# EasyEDA Pro project OctoSlime_Base_Unit.eprj

# Schematic Octoslime

## Sheets
1 I2C breakout and OLED
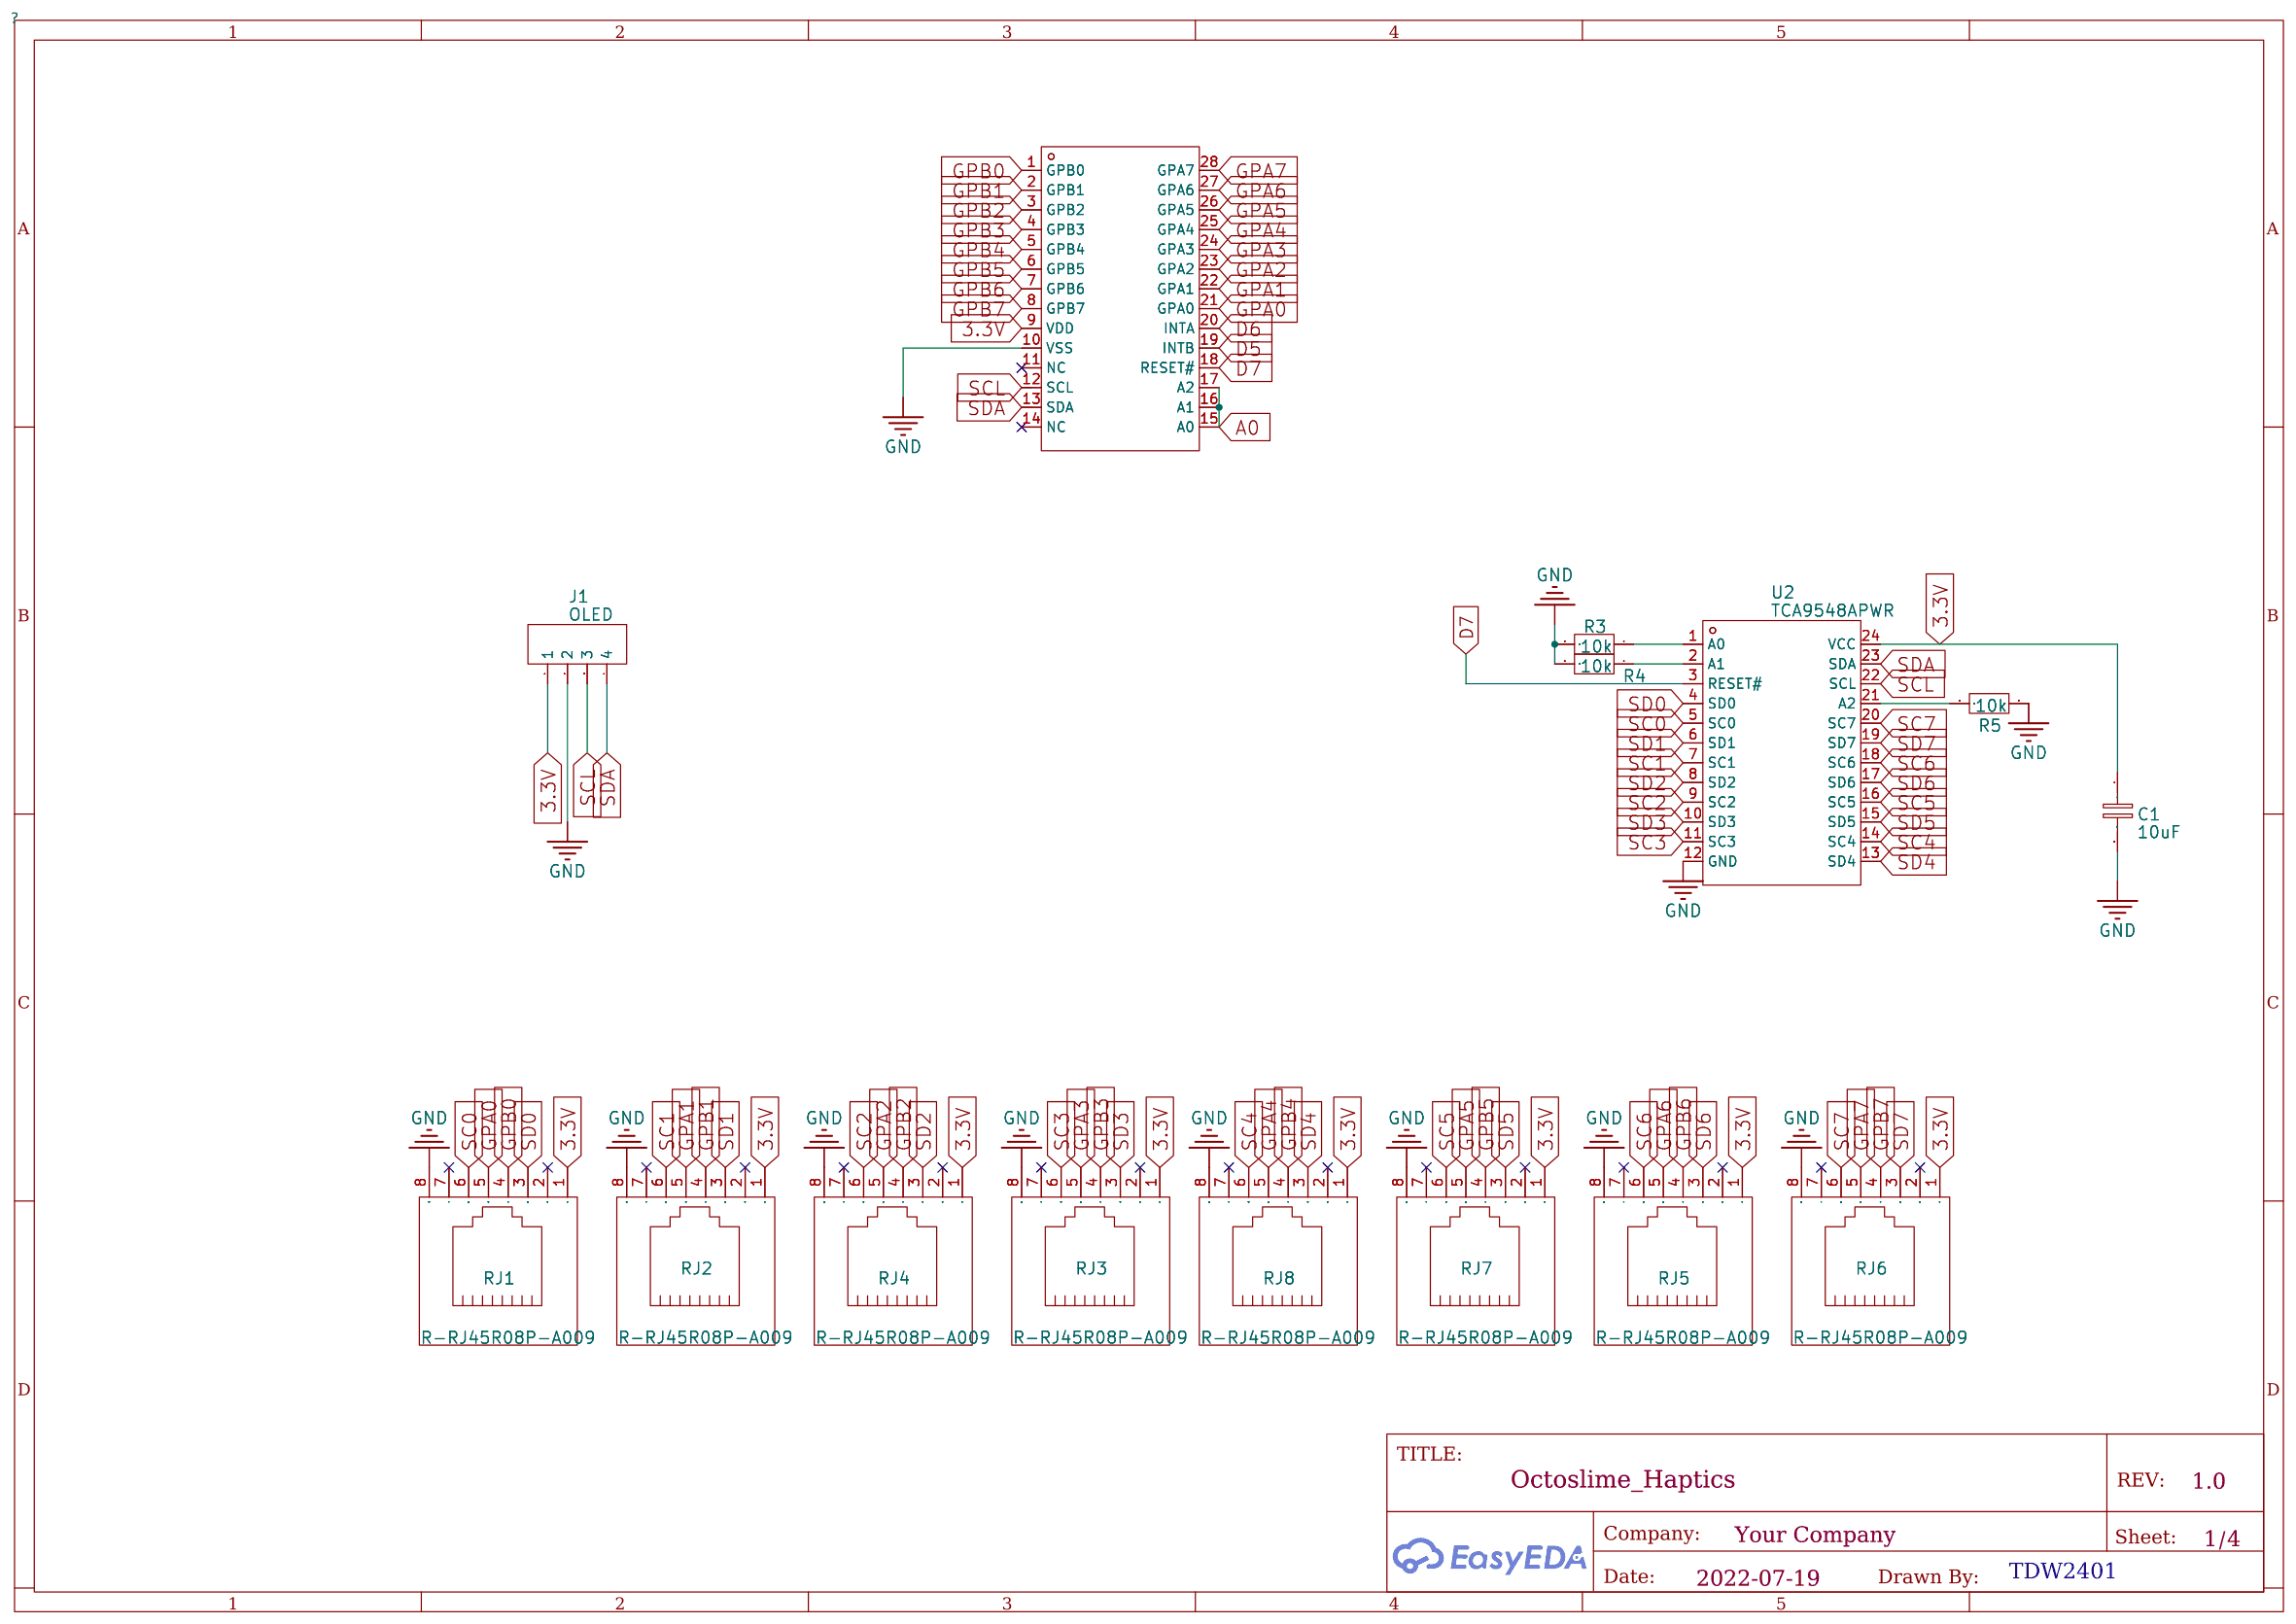
[diagram p0: I2C breakout and OLED]
2 Charge / data
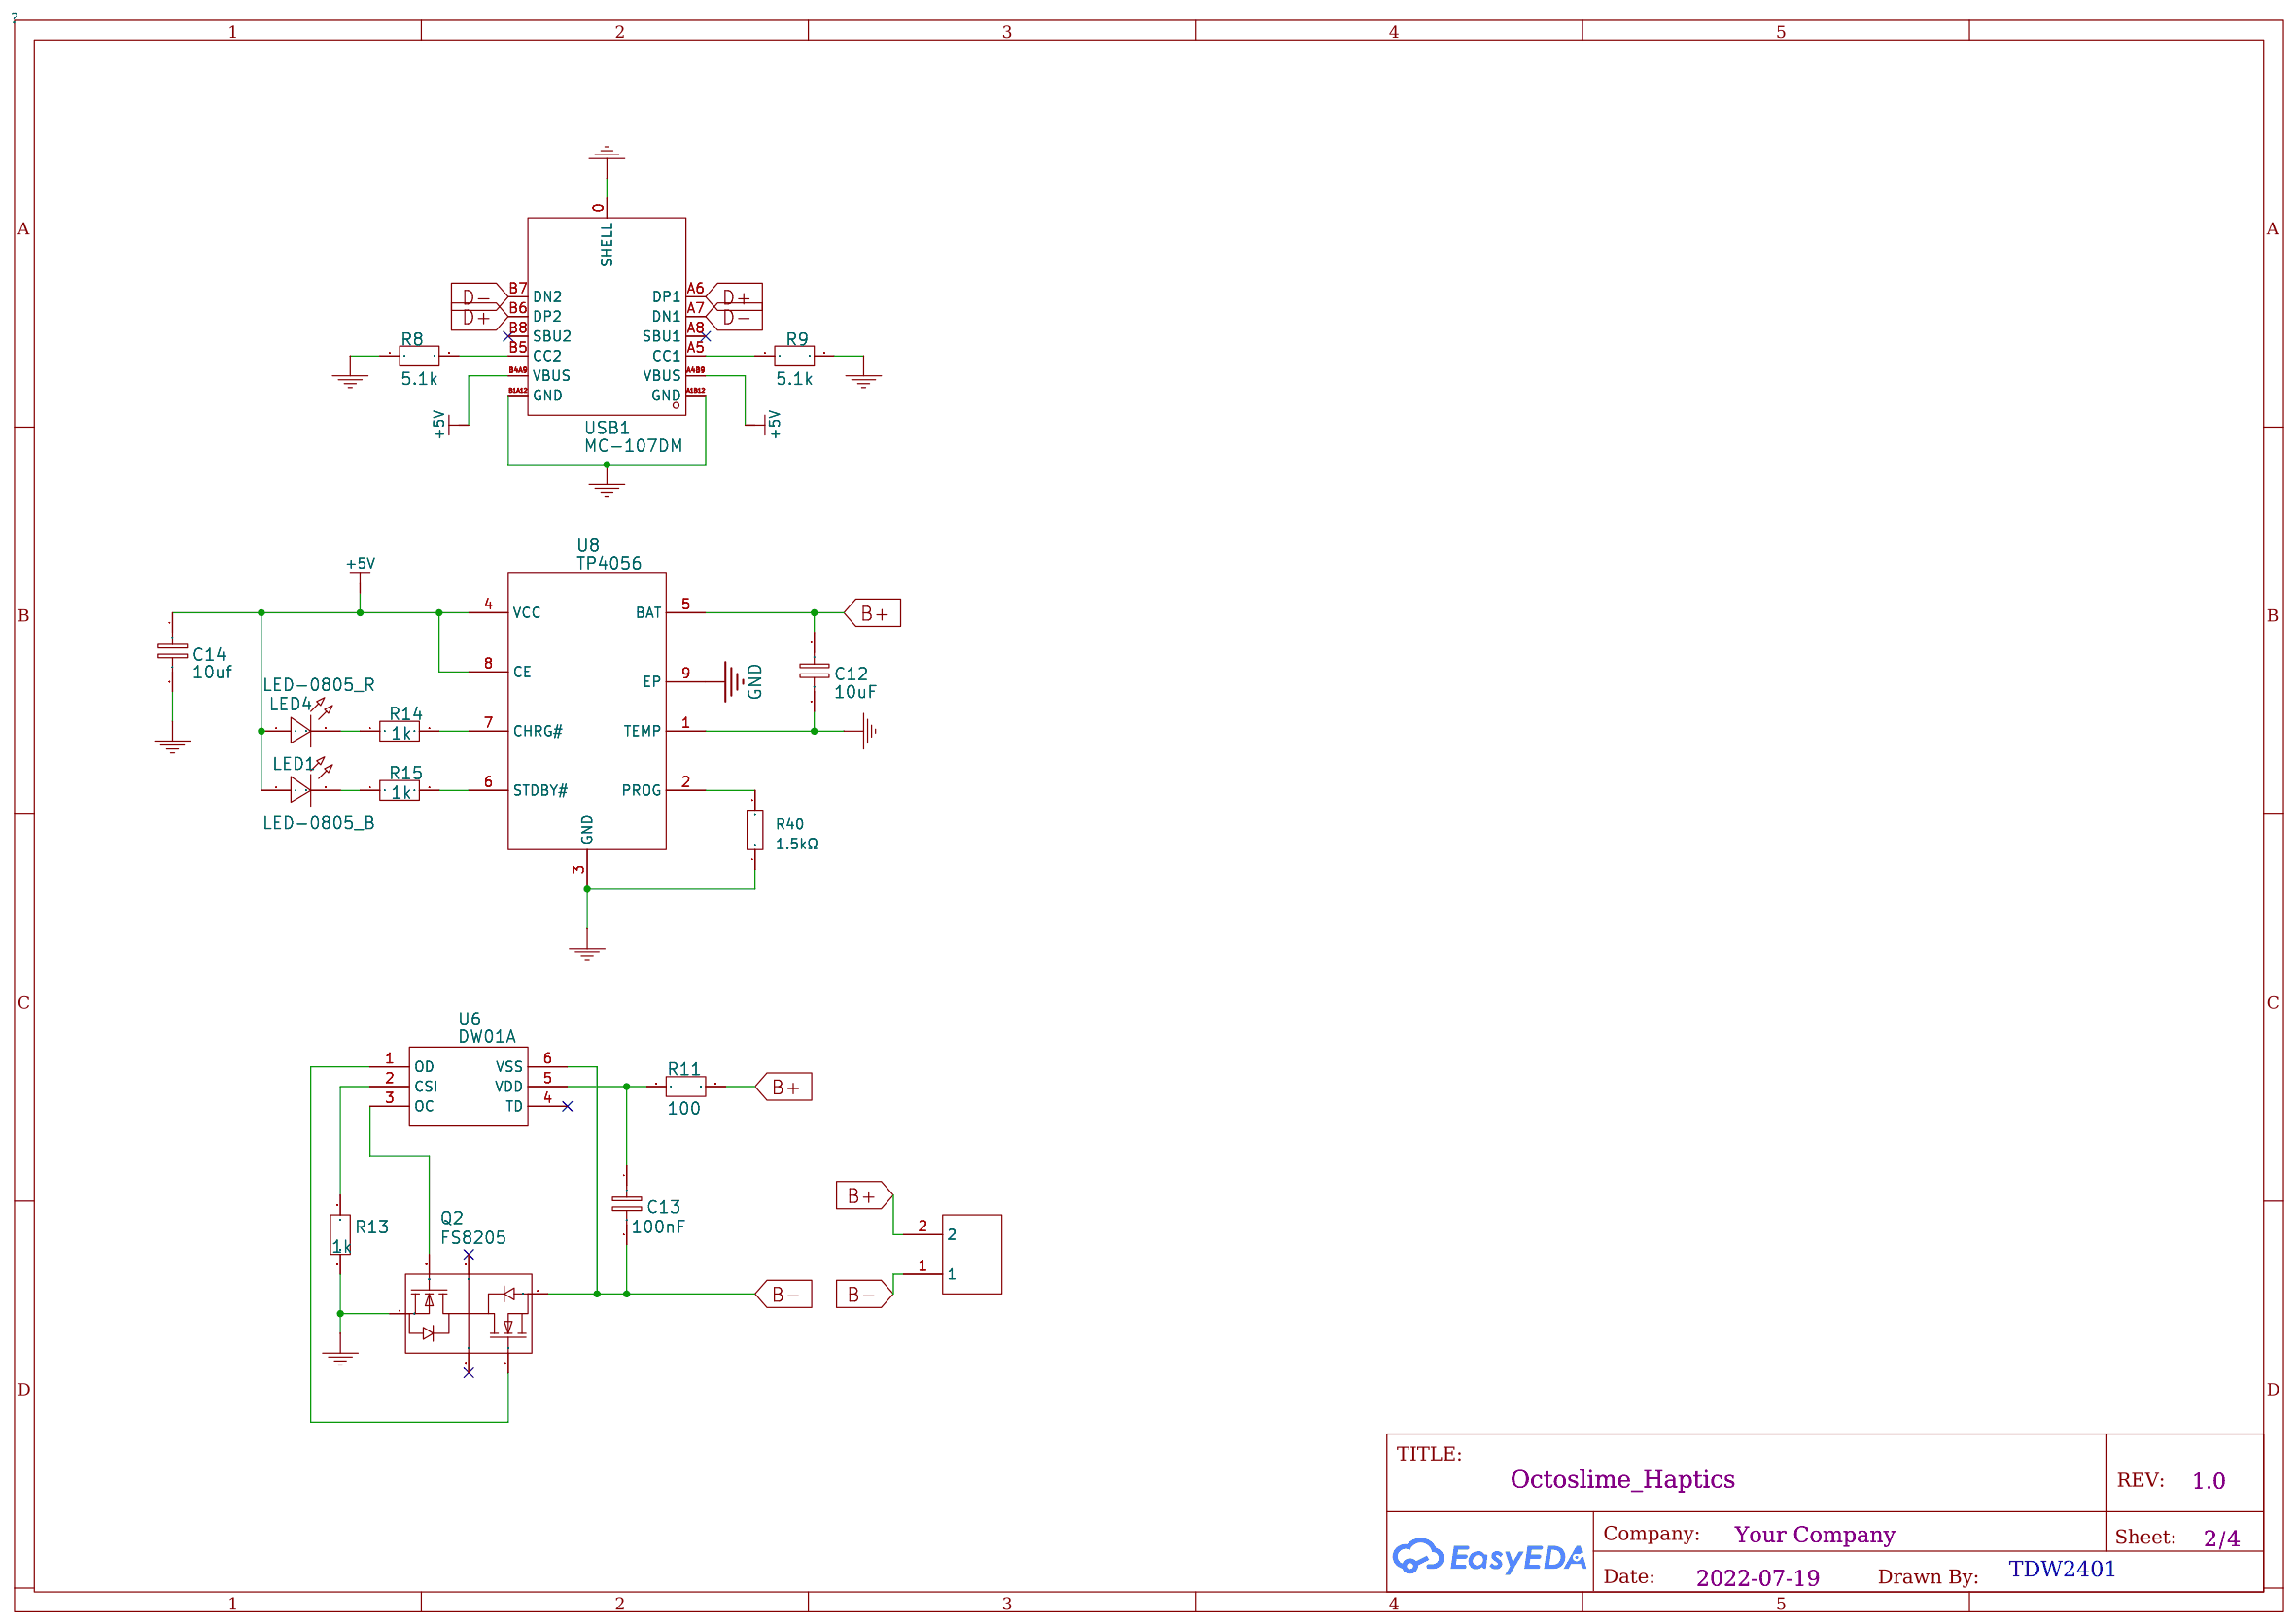
[diagram p1: Charge / data]
3 MCU
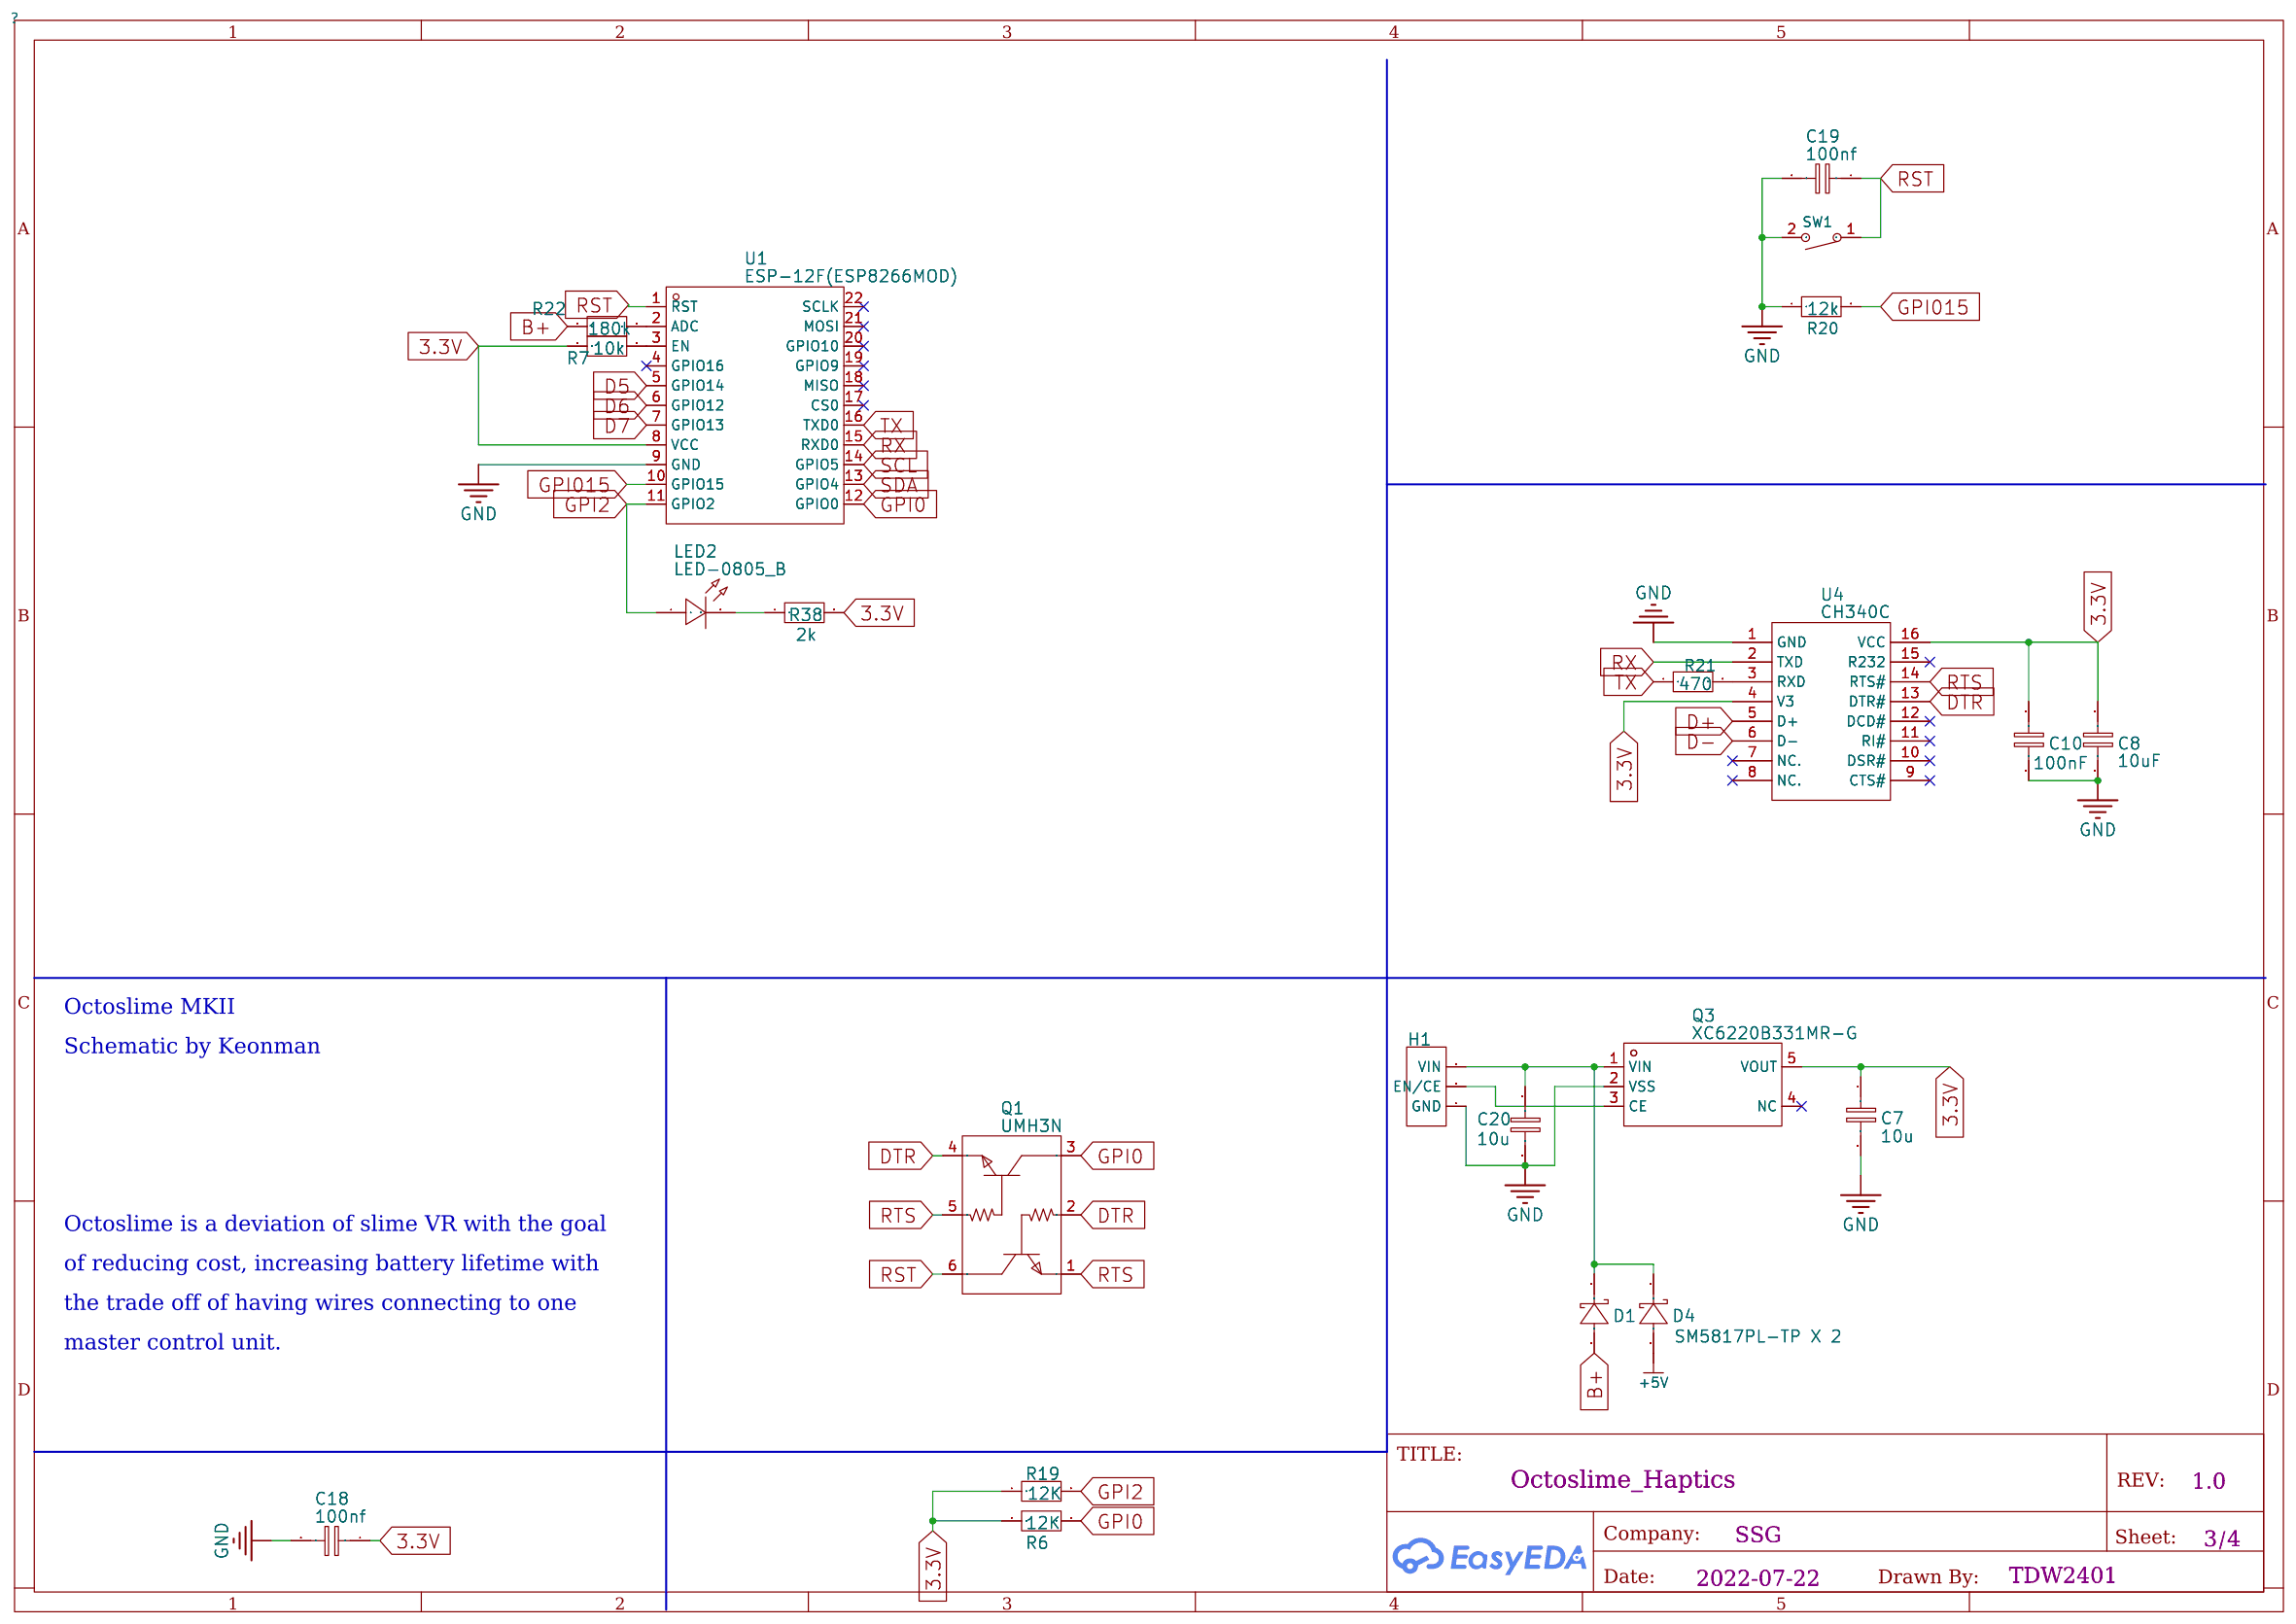
[diagram p2: MCU]
4 I2C thing - ma - jigXC6220B331PR-G
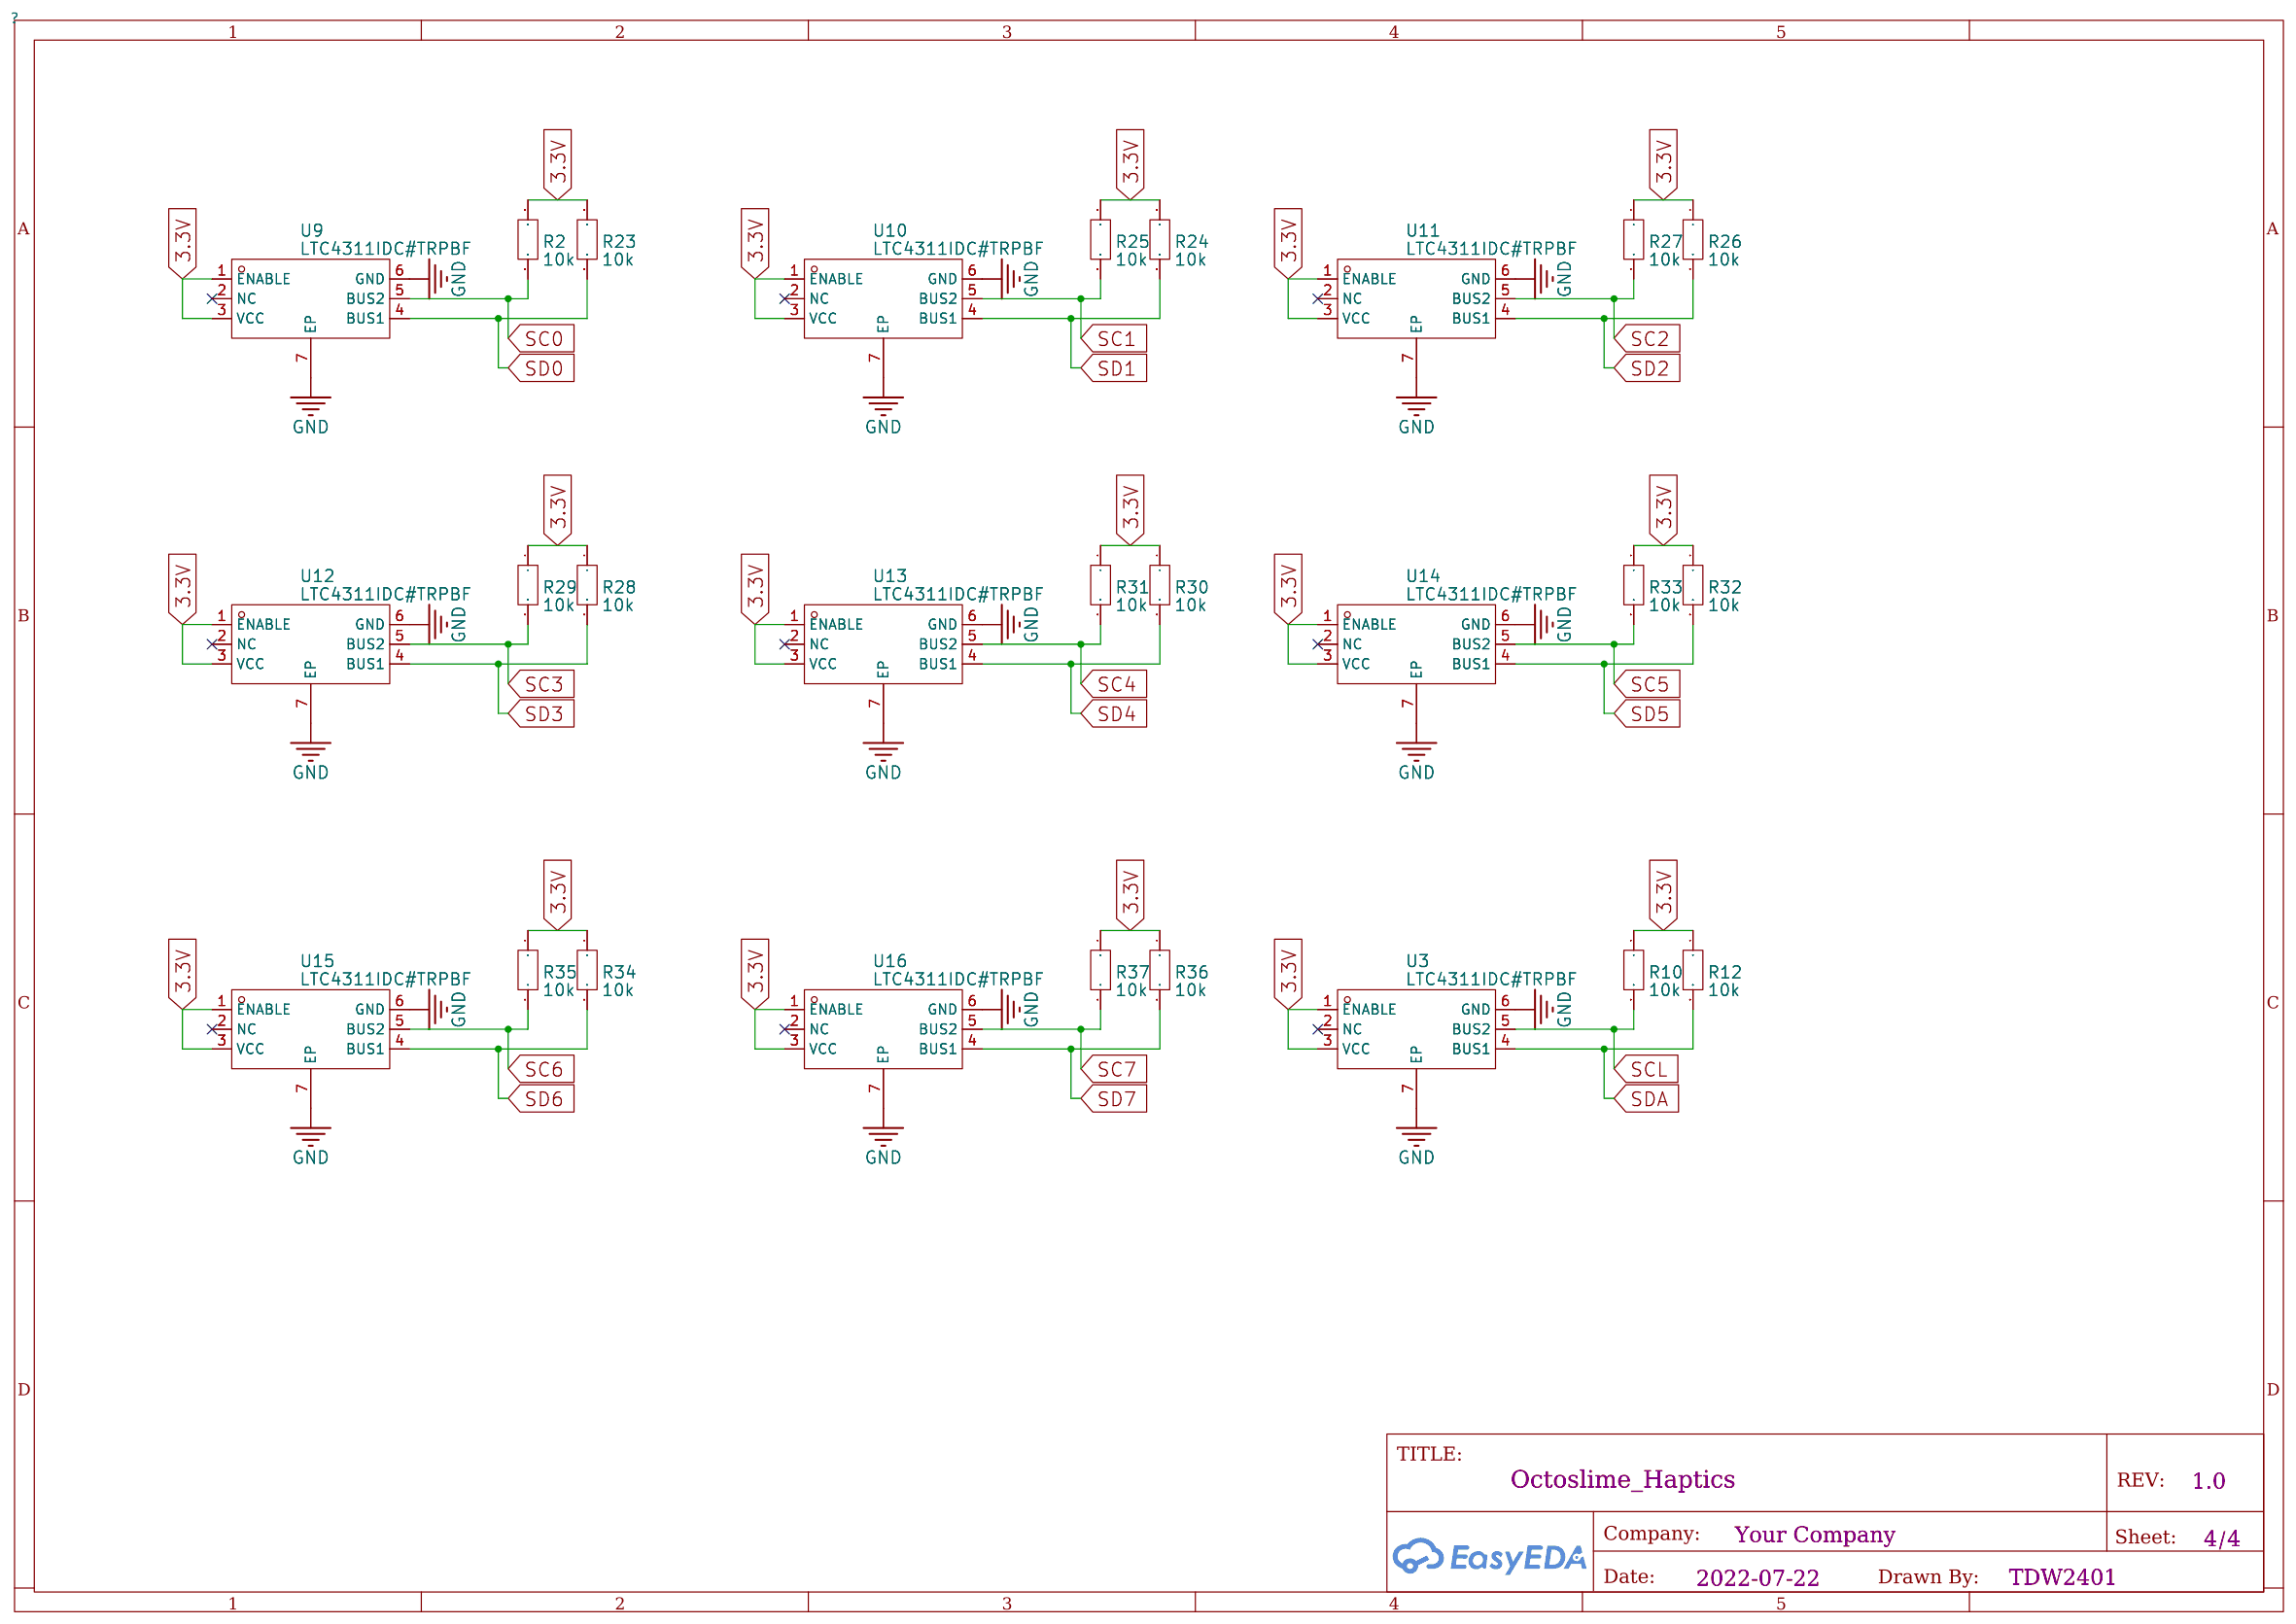
[diagram p3: I2C thing - ma - jigXC6220B331PR-G]

## Parts
sheet Charge / data
C12  10uF  [C0805]
C13  100nF  [C0805]
C14  10uf  [C0805]
CN8  B2B-PH-K-S(LF)(SN)  [CONN-TH_B2B-PH-K-S]
LED1  LED-0805_B  [LED0805_BLUE]
LED4  LED-0805_R  [LED0805_RED]
Q2  FS8205  [SOT-23-6_L2.9-W1.6-P0.95-LS2.8-BR]
R8  5.1k  [R0805]
R9  5.1k  [R0805]
R11  100  [R0805]
R13  1k  [R0805]
R14  1k  [R0805]
R15  1k  [R0805]
R40  1.5kΩ  [R0805]
U6  DW01A  [SOT-23-6_L2.9-W1.6-P0.95-LS2.8-BL]
U8  TP4056  [ESOP-8_L4.9-W3.9-P1.27-LS6.0-BL-EP]
USB1  MC-107DM  [USB-C-SMD_MC-107D]
sheet I2C breakout and OLED
C1  10uF  [C0805]
J1  OLED  [HDR-M-2.54_1X4]  (no BOM)
R3  10k  [R0805]
R4  10k  [R0805]
R5  10k  [R0805]
RJ1  R-RJ45R08P-A009  [RJ45-TH_R-RJ45R08P-A009]
RJ2  R-RJ45R08P-A009  [RJ45-TH_R-RJ45R08P-A009]
RJ3  R-RJ45R08P-A009  [RJ45-TH_R-RJ45R08P-A009]
RJ4  R-RJ45R08P-A009  [RJ45-TH_R-RJ45R08P-A009]
RJ5  R-RJ45R08P-A009  [RJ45-TH_R-RJ45R08P-A009]
RJ6  R-RJ45R08P-A009  [RJ45-TH_R-RJ45R08P-A009]
RJ7  R-RJ45R08P-A009  [RJ45-TH_R-RJ45R08P-A009]
RJ8  R-RJ45R08P-A009  [RJ45-TH_R-RJ45R08P-A009]
U2  TCA9548APWR  [TSSOP-24_L7.8-W4.4-P0.65-LS6.4-BL]
U7  -  [SOIC-28_L18.0-W7.5-P1.27-LS10.3-BL]
sheet I2C thing - ma - jigXC6220B331PR-G
R2  10k  [R0805]
R10  10k  [R0805]
R12  10k  [R0805]
R23  10k  [R0805]
R24  10k  [R0805]
R25  10k  [R0805]
R26  10k  [R0805]
R27  10k  [R0805]
R28  10k  [R0805]
R29  10k  [R0805]
R30  10k  [R0805]
R31  10k  [R0805]
R32  10k  [R0805]
R33  10k  [R0805]
R34  10k  [R0805]
R35  10k  [R0805]
R36  10k  [R0805]
R37  10k  [R0805]
U3  LTC4311IDC#TRPBF  [DFN-6_L2.0-W2.0-P0.50-BL-EP]
U9  LTC4311IDC#TRPBF  [DFN-6_L2.0-W2.0-P0.50-BL-EP]
U10  LTC4311IDC#TRPBF  [DFN-6_L2.0-W2.0-P0.50-BL-EP]
U11  LTC4311IDC#TRPBF  [DFN-6_L2.0-W2.0-P0.50-BL-EP]
U12  LTC4311IDC#TRPBF  [DFN-6_L2.0-W2.0-P0.50-BL-EP]
U13  LTC4311IDC#TRPBF  [DFN-6_L2.0-W2.0-P0.50-BL-EP]
U14  LTC4311IDC#TRPBF  [DFN-6_L2.0-W2.0-P0.50-BL-EP]
U15  LTC4311IDC#TRPBF  [DFN-6_L2.0-W2.0-P0.50-BL-EP]
U16  LTC4311IDC#TRPBF  [DFN-6_L2.0-W2.0-P0.50-BL-EP]
sheet MCU
C7  10u  [C0805]
C8  10uF  [C0805]
C10  100nF  [C0805]
C18  100nf  [C0805]
C19  100nf  [C0805]
C20  10u  [C0805]
D1  SM5817PL-TP X 2  [SOD-123FL_L2.8-W1.7-LS3.6-RD]
D4  SM5817PL-TP X 2  [SOD-123FL_L2.8-W1.7-LS3.6-RD]
H1  HDR-F-2.54_1x3  [HDR-F-2.54_1X3]  (no BOM)
LED2  LED-0805_B  [LED0805_BLUE]
Q1  UMH3N  [SC-70-6_L2.2-W1.3-P0.65-LS2.1-BR]
Q3  XC6220B331MR-G  [SOT-25-5_L3.0-W1.8-P0.95-LS3.0-BR]
R6  12K  [R0805]
R7  10k  [R0805]
R19  12K  [R0805]
R20  12k  [R0805]
R21  470  [R0805]
R22  180k  [R0805]
R38  2k  [R0805]
SW1  -  [SW-SMD_L4.0-W2.9-LS5.0]
U1  ESP-12F(ESP8266MOD)  [WIFIM-SMD_ESP-12F-ESP8266MOD]
U4  CH340C  [SOP-16_L10.0-W3.9-P1.27-LS6.0-BL]

## Library data of the parts
C1 C8 C12 = 10uF: link: https://item.szlcsc.com/373011.html; 3DModel: C0805_L2.0-W1.3-H1.3
C10 C13 = 100nF: link: https://item.szlcsc.com/373011.html; 3DModel: C0805_L2.0-W1.3-H1.3
C14 = 10uf: link: https://item.szlcsc.com/373011.html; 3DModel: C0805_L2.0-W1.3-H1.3
CN8 = B2B-PH-K-S(LF)(SN): link: https://item.szlcsc.com/142630.html; 3DModel: CONN-TH_PH2.00-LI-2P; Supplier: LCSC; Manufacturer: JST; Supplier Part: C131337; JLCPCB Part Class: Extended Part
LED1 LED2 = LED-0805_B: 3DModel: LED0805_Blue; Manufacturer: 方舟 ARKLED; Manufacturer Part: D-B080508B1-KS2; Supplier Part: C108412
LED4 = LED-0805_R: 3DModel: LED0805_Red; Manufacturer: EVERLIGHT(台湾亿光); Manufacturer Part: 17-21SURC/S530-A3/TR8; Supplier Part: C72037
Q2 = FS8205: link: https://item.szlcsc.com/169042.html; 3DModel: SOT-23-6_L2.9-W1.6-H1.5-LS2.8-P0.95; Supplier: LCSC; Manufacturer: FORTUNE; Supplier Part: C32254; JLCPCB Part Class: Extended Part
R8 R9 = 5.1k: link: https://item.szlcsc.com/142685.html; 3DModel: R0805_L2.0-W1.3-H0.6
R11 = 100: link: https://item.szlcsc.com/142685.html; 3DModel: R0805_L2.0-W1.3-H0.6
R13-R15 = 1k: link: https://item.szlcsc.com/142685.html; 3DModel: R0805_L2.0-W1.3-H0.6
R40 = 0805W8F1501T5E: 电阻类型:厚膜电阻;阻值:1.5kΩ;精度:±1%;功率:125mW;温度系数:±100ppm/;最大工作电压:150V;工作温度范围:-55~+155;; LCSC Part Name: 1.5kΩ ±1% 125mW; Supplier Part: C4310; Manufacturer: UNI-ROYAL(厚声); Supplier Footprint: 0805; JLCPCB Part Class: Basic Part; Datasheet: https://atta.szlcsc.com/upload/public/pdf/source/20200306/C422600_1E6D84923E4A46A82E41ADD87F860B5C.pdf; Supplier: LCSC; Type: 厚膜电阻; Tolerance: ±1%; Power(Watts): 125mW; Temperature Coefficient: ±100ppm/; Overload Voltage (Max): 150V; Operating Temperature Range: -55~+155
U6 = DW01A: link: https://item.szlcsc.com/169042.html; 3DModel: SOT-23-6_L2.9-W1.6-H1.5-LS2.8-P0.95; Supplier: LCSC; Manufacturer: FM; Supplier Part: C85680; JLCPCB Part Class: Extended Part
U8 = TP4056: link: https://www.mornsun.cn/html/pdf/SCM1501B.html; 3DModel: ESOP-8_L4.9-W3.9-H1.6-LS6.0-P1.27; Supplier: LCSC; Manufacturer: TOPPOWER; Supplier Part: C16581; JLCPCB Part Class: Basic Part
USB1 = MC-107DM: link: https://atta.szlcsc.com/upload/public/pdf/source/20210810/6DD818F077A767CCD2FDFBDED48F58DC.pdf; Supplier: LCSC; Supplier Part: C2874569; Manufacturer: 台湾汉博; JLCPCB Part Class: Extended Part
J1 = OLED: 3DModel: HDR-M-2.54_1x4; Supplier Part: C124378; Supplier: LCSC
R2-R5 R7 R10 R12 R23-R37 = 10k: link: https://item.szlcsc.com/142685.html; 3DModel: R0805_L2.0-W1.3-H0.6
RJ1-RJ8 = R-RJ45R08P-A009: link: https://atta.szlcsc.com/upload/public/pdf/source/20211021/D54662BD8381AD1D1DF920996089EE18.pdf; Supplier: LCSC; Supplier Part: C2902700; Manufacturer: Ckmtw(灿科盟); JLCPCB Part Class: Extended Part
U2 = TCA9548APWR: link: https://item.szlcsc.com/6601.html; 3DModel: TSSOP-24_L7.8-W4.4-H1.0-LS6.4-P0.65; Supplier: LCSC; Manufacturer: TI; Supplier Part: C130026; JLCPCB Part Class: Extended Part
U7 = MCP23017-E/SO: Number of I/O:16 Interface:I²C Interrupt Output:是 Features:POR Output Type:推挽式 Current - Output Source/Sink:25mA Clock Frequency:1.7MHz Voltage - Supply:1.8V ~ 5.5V Operating Temperature:-40~125 Mounting Type:表面贴装; Supplier Part: C47023; Manufacturer: MICROCHIP(美国微芯); Supplier Footprint: SOIC-28_300mil; JLCPCB Part Class: Extended Part; Datasheet: https://atta.szlcsc.com/upload/public/pdf/source/20150427/1457707279254.pdf; Supplier: LCSC; Number of I/O: 16; Interface: I²C; Interrupt Output: 是; Features: POR; Output Type: 推挽式; Current - Output Source/Sink: 25mA; Clock Frequency: 1.7MHz; Voltage - Supply: 1.8V ~ 5.5V; Operating Temperature: -40~125; Mounting Type: 表面贴装
U3 U9-U16 = LTC4311IDC#TRPBF: link: https://item.szlcsc.com/216405.html; 3DModel: DFN-6_L2.0-W2.0-H0.8-P0.50; Supplier: LCSC; Supplier Part: C688096; Manufacturer: Analog Devices; JLCPCB Part Class: Extended Part
C7 C20 = 10u: link: https://item.szlcsc.com/373011.html; 3DModel: C0805_L2.0-W1.3-H1.3
C18 C19 = 100nf: link: https://item.szlcsc.com/373011.html; 3DModel: C0805_L2.0-W1.3-H1.3
D1 D4 = SM5817PL-TP X 2: link: https://item.szlcsc.com/771782.html; Supplier: LCSC; Supplier Part: C669022; Manufacturer: MCC(Micro Commercial Components); Manufacturer Part: SM5817PL-TP; JLCPCB Part Class: Extended Part
H1 = HDR-F-2.54_1x3: link: https://www.cjt.com/Upload/A2541.pdf; Supplier Part: C146690; Supplier: LCSC
Q1 = UMH3N: link: https://item.szlcsc.com/112963.html; 3DModel: SC-70-6_L2.1-W1.3-H1.0-LS2.1-P0.65; Supplier: LCSC; Manufacturer: CJ; Supplier Part: C62892; JLCPCB Part Class: Extended Part
Q3 = XC6220B331MR-G: link: https://item.szlcsc.com/70677.html; 3DModel: SOT-25-5_L3.0-W1.6-H1.3-LS2.8-P0.95; Supplier: LCSC; Manufacturer: TOREX; Supplier Part: C86534; JLCPCB Part Class: Extended Part
R6 R19 = 12K: link: https://item.szlcsc.com/142685.html; 3DModel: R0805_L2.0-W1.3-H0.6
R20 = 12k: link: https://item.szlcsc.com/142685.html; 3DModel: R0805_L2.0-W1.3-H0.6
R21 = 470: link: https://item.szlcsc.com/142685.html; 3DModel: R0805_L2.0-W1.3-H0.6
R22 = 180k: link: https://item.szlcsc.com/142685.html; 3DModel: R0805_L2.0-W1.3-H0.6
R38 = 2k: link: https://item.szlcsc.com/142685.html; 3DModel: R0805_L2.0-W1.3-H0.6
SW1 = TS342A2P-WZ: LCSC Part Name: 轻触开关 3*4*2 两脚小龟不带柱 250gf 黑色塑胶按钮; Supplier Part: C557591; Manufacturer: SHOU HAN(首韩); Supplier Footprint: SMD; JLCPCB Part Class: Extended Part; Datasheet: https://atta.szlcsc.com/upload/public/pdf/source/20200519/C557591_B3A5A21584733303F06306F18577DA8B.pdf; Supplier: LCSC
U1 = ESP-12F(ESP8266MOD): link: https://item.szlcsc.com/84052.html; 3DModel: WIFIM-SMD_WIFI-L24.0-W16.0-H3.1; Supplier: LCSC; Manufacturer: Ai-Thinker; Supplier Part: C82891; JLCPCB Part Class: Extended Part
U4 = CH340C: link: https://item.szlcsc.com/391677.html; Supplier Part: C84681; Supplier: LCSC; 3DModel: SOP-16_L9.9-W3.9-H1.5-LS6.0-P1.27; Manufacturer: WCH; JLCPCB Part Class: Extended Part

## Nets
3.3V: C1.1 C7.1 C8.1 C10.1 C18.1 J1.1 Q3.5(VOUT) R2.1 R6.1 R7.1 R10.1 R12.1 R19.1 R23.1 R24.1 R25.1 R26.1 R27.1 R28.1 R29.1 R30.1 R31.1 R32.1 R33.1 R34.1 R35.1 R36.1 R37.1 R38.2 RJ1.1 RJ2.1 RJ3.1 RJ4.1 RJ5.1 RJ6.1 RJ7.1 RJ8.1 U1.8(VCC) U2.24(VCC) U3.1(ENABLE) U3.3(VCC) U4.4(V3) U4.16(VCC) U7.9(VDD) U9.1(ENABLE) U9.3(VCC) U10.1(ENABLE) U10.3(VCC) U11.1(ENABLE) U11.3(VCC) U12.1(ENABLE) U12.3(VCC) U13.1(ENABLE) U13.3(VCC) U14.1(ENABLE) U14.3(VCC) U15.1(ENABLE) U15.3(VCC) U16.1(ENABLE) U16.3(VCC)
+5V: C14.1 D4.2(A) LED1.1 LED4.1 U8.4(VCC) U8.8(CE) USB1.A4B9(VBUS) USB1.B4A9(VBUS)
GND: C1.2 C7.2 C8.2 C10.2 C12.2 C14.2 C18.2 C19.2 C20.2 H1.1(GND) J1.2 Q2.1(S1) Q3.2(VSS) R3.2 R4.2 R5.1 R8.1 R9.2 R13.2 R20.1 R40.1 RJ1.8 RJ2.8 RJ3.8 RJ4.8 RJ5.8 RJ6.8 RJ7.8 RJ8.8 SW1.2 U1.9(GND) U2.12(GND) U3.6(GND) U3.7(EP) U4.1(GND) U7.10(VSS) U8.1(TEMP) U8.3(GND) U8.9(EP) U9.6(GND) U9.7(EP) U10.6(GND) U10.7(EP) U11.6(GND) U11.7(EP) U12.6(GND) U12.7(EP) U13.6(GND) U13.7(EP) U14.6(GND) U14.7(EP) U15.6(GND) U15.7(EP) U16.6(GND) U16.7(EP) USB1.0(SHELL) USB1.A1B12(GND) USB1.B1A12(GND)
A0: U7.15(A0) U7.16(A1) U7.17(A2)
B+: C12.1 CN8.2 D1.2(A) R11.2 R22.1 U8.5(BAT)
B-: C13.2 CN8.1 Q2.3(S2) U6.6(VSS)
CHRG#: R14.2 U8.7(CHRG#)
D5: U1.5(GPIO14) U7.19(INTB)
D6: U1.6(GPIO12) U7.20(INTA)
D7: U1.7(GPIO13) U2.3(RESET#) U7.18(RESET#)
D+: U4.5(D+) USB1.A6(DP1) USB1.B6(DP2)
D-: U4.6(D-) USB1.A7(DN1) USB1.B7(DN2)
DTR: Q1.2(B) Q1.4(E) U4.13(DTR#)
GPA0: RJ1.5 U7.21(GPA0)
GPA1: RJ2.5 U7.22(GPA1)
GPA2: RJ4.5 U7.23(GPA2)
GPA3: RJ3.5 U7.24(GPA3)
GPA4: RJ8.5 U7.25(GPA4)
GPA5: RJ7.5 U7.26(GPA5)
GPA6: RJ5.5 U7.27(GPA6)
GPA7: RJ6.5 U7.28(GPA7)
GPB0: RJ1.4 U7.1(GPB0)
GPB1: RJ2.4 U7.2(GPB1)
GPB2: RJ4.4 U7.3(GPB2)
GPB3: RJ3.4 U7.4(GPB3)
GPB4: RJ8.4 U7.5(GPB4)
GPB5: RJ7.4 U7.6(GPB5)
GPB6: RJ5.4 U7.7(GPB6)
GPB7: RJ6.4 U7.8(GPB7)
GPI0: Q1.3(C) R6.2 U1.12(GPIO0)
GPI2: LED2.1 R19.2 U1.11(GPIO2)
GPI015: R20.2 U1.10(GPIO15)
OUT+: C20.1 D1.1(C) D4.1(C) H1.3(VIN) Q3.1(VIN)
RPROG: R40.2 U8.2(PROG)
RST: C19.1 Q1.6(C) SW1.1 U1.1(RST)
RTS: Q1.1(E) Q1.5(B) U4.14(RTS#)
RX: U1.15(RXD0) U4.2(TXD)
SC0: R2.2 RJ1.6 U2.5(SC0) U9.5(BUS2)
SC1: R25.2 RJ2.6 U2.7(SC1) U10.5(BUS2)
SC2: R27.2 RJ4.6 U2.9(SC2) U11.5(BUS2)
SC3: R29.2 RJ3.6 U2.11(SC3) U12.5(BUS2)
SC4: R31.2 RJ8.6 U2.14(SC4) U13.5(BUS2)
SC5: R33.2 RJ7.6 U2.16(SC5) U14.5(BUS2)
SC6: R35.2 RJ5.6 U2.18(SC6) U15.5(BUS2)
SC7: R37.2 RJ6.6 U2.20(SC7) U16.5(BUS2)
SCL: J1.3 R10.2 U1.14(GPIO5) U2.22(SCL) U3.5(BUS2) U7.12(SCL)
SD0: R23.2 RJ1.3 U2.4(SD0) U9.4(BUS1)
SD1: R24.2 RJ2.3 U2.6(SD1) U10.4(BUS1)
SD2: R26.2 RJ4.3 U2.8(SD2) U11.4(BUS1)
SD3: R28.2 RJ3.3 U2.10(SD3) U12.4(BUS1)
SD4: R30.2 RJ8.3 U2.13(SD4) U13.4(BUS1)
SD5: R32.2 RJ7.3 U2.15(SD5) U14.4(BUS1)
SD6: R34.2 RJ5.3 U2.17(SD6) U15.4(BUS1)
SD7: R36.2 RJ6.3 U2.19(SD7) U16.4(BUS1)
SDA: J1.4 R12.2 U1.13(GPIO4) U2.23(SDA) U3.4(BUS1) U7.13(SDA)
STDBY#: R15.2 U8.6(STDBY#)
TX: R21.1 U1.16(TXD0)
$1N65: R4.1 U2.2(A1)
$1N66: R3.1 U2.1(A0)
$1N67: R5.2 U2.21(A2)
$2N78: R8.2 USB1.B5(CC2)
$2N79: R9.1 USB1.A5(CC1)
$2N179: LED1.2 R15.1
$2N191: LED4.2 R14.1
$2N237: Q2.6(G1) U6.3(OC)
$2N238: Q2.4(G2) U6.1(OD)
$2N249: C13.1 R11.1 U6.5(VDD)
$2N267: R13.1 U6.2(CSI)
$3N362: LED2.2 R38.1
$3N452: R7.2 U1.3(EN)
$3N457: R21.2 U4.3(RXD)
$3N474: R22.2 U1.2(ADC)
Net-(H1-2): H1.2(EN/CE) Q3.3(CE)

Not connected (* = marked no-connect by the designer): Q2 2(D12)* 5(D12)*; Q3 4(NC)*; RJ1 2* 7*; RJ2 2* 7*; RJ3 2* 7*; RJ4 2* 7*; RJ5 2* 7*; RJ6 2* 7*; RJ7 2* 7*; RJ8 2* 7*; U1 4(GPIO16)* 17(CS0)* 18(MISO)* 19(GPIO9)* 20(GPIO10)* 21(MOSI)* 22(SCLK)*; U3 2(NC)*; U4 7(NC.)* 8(NC.)* 9(CTS#)* 10(DSR#)* 11(RI#)* 12(DCD#)* 15(R232)*; U6 4(TD)*; U7 11(NC)* 14(NC)*; U9 2(NC)*; U10 2(NC)*; U11 2(NC)*; U12 2(NC)*; U13 2(NC)*; U14 2(NC)*; U15 2(NC)*; U16 2(NC)*; USB1 A8(SBU1)* B8(SBU2)*

## Notes on the sheets
sheet 1
- TDW2401
sheet 2
- TDW2401
sheet 3
- Octoslime MKII
- Schematic by Keonman
- Octoslime is a deviation of slime VR with the goal
- of reducing cost, increasing battery lifetime with
- the trade off of having wires connecting to one
- master control unit.

# Board PCB_PCB_Octoslime_3_2022-08-10_PCB
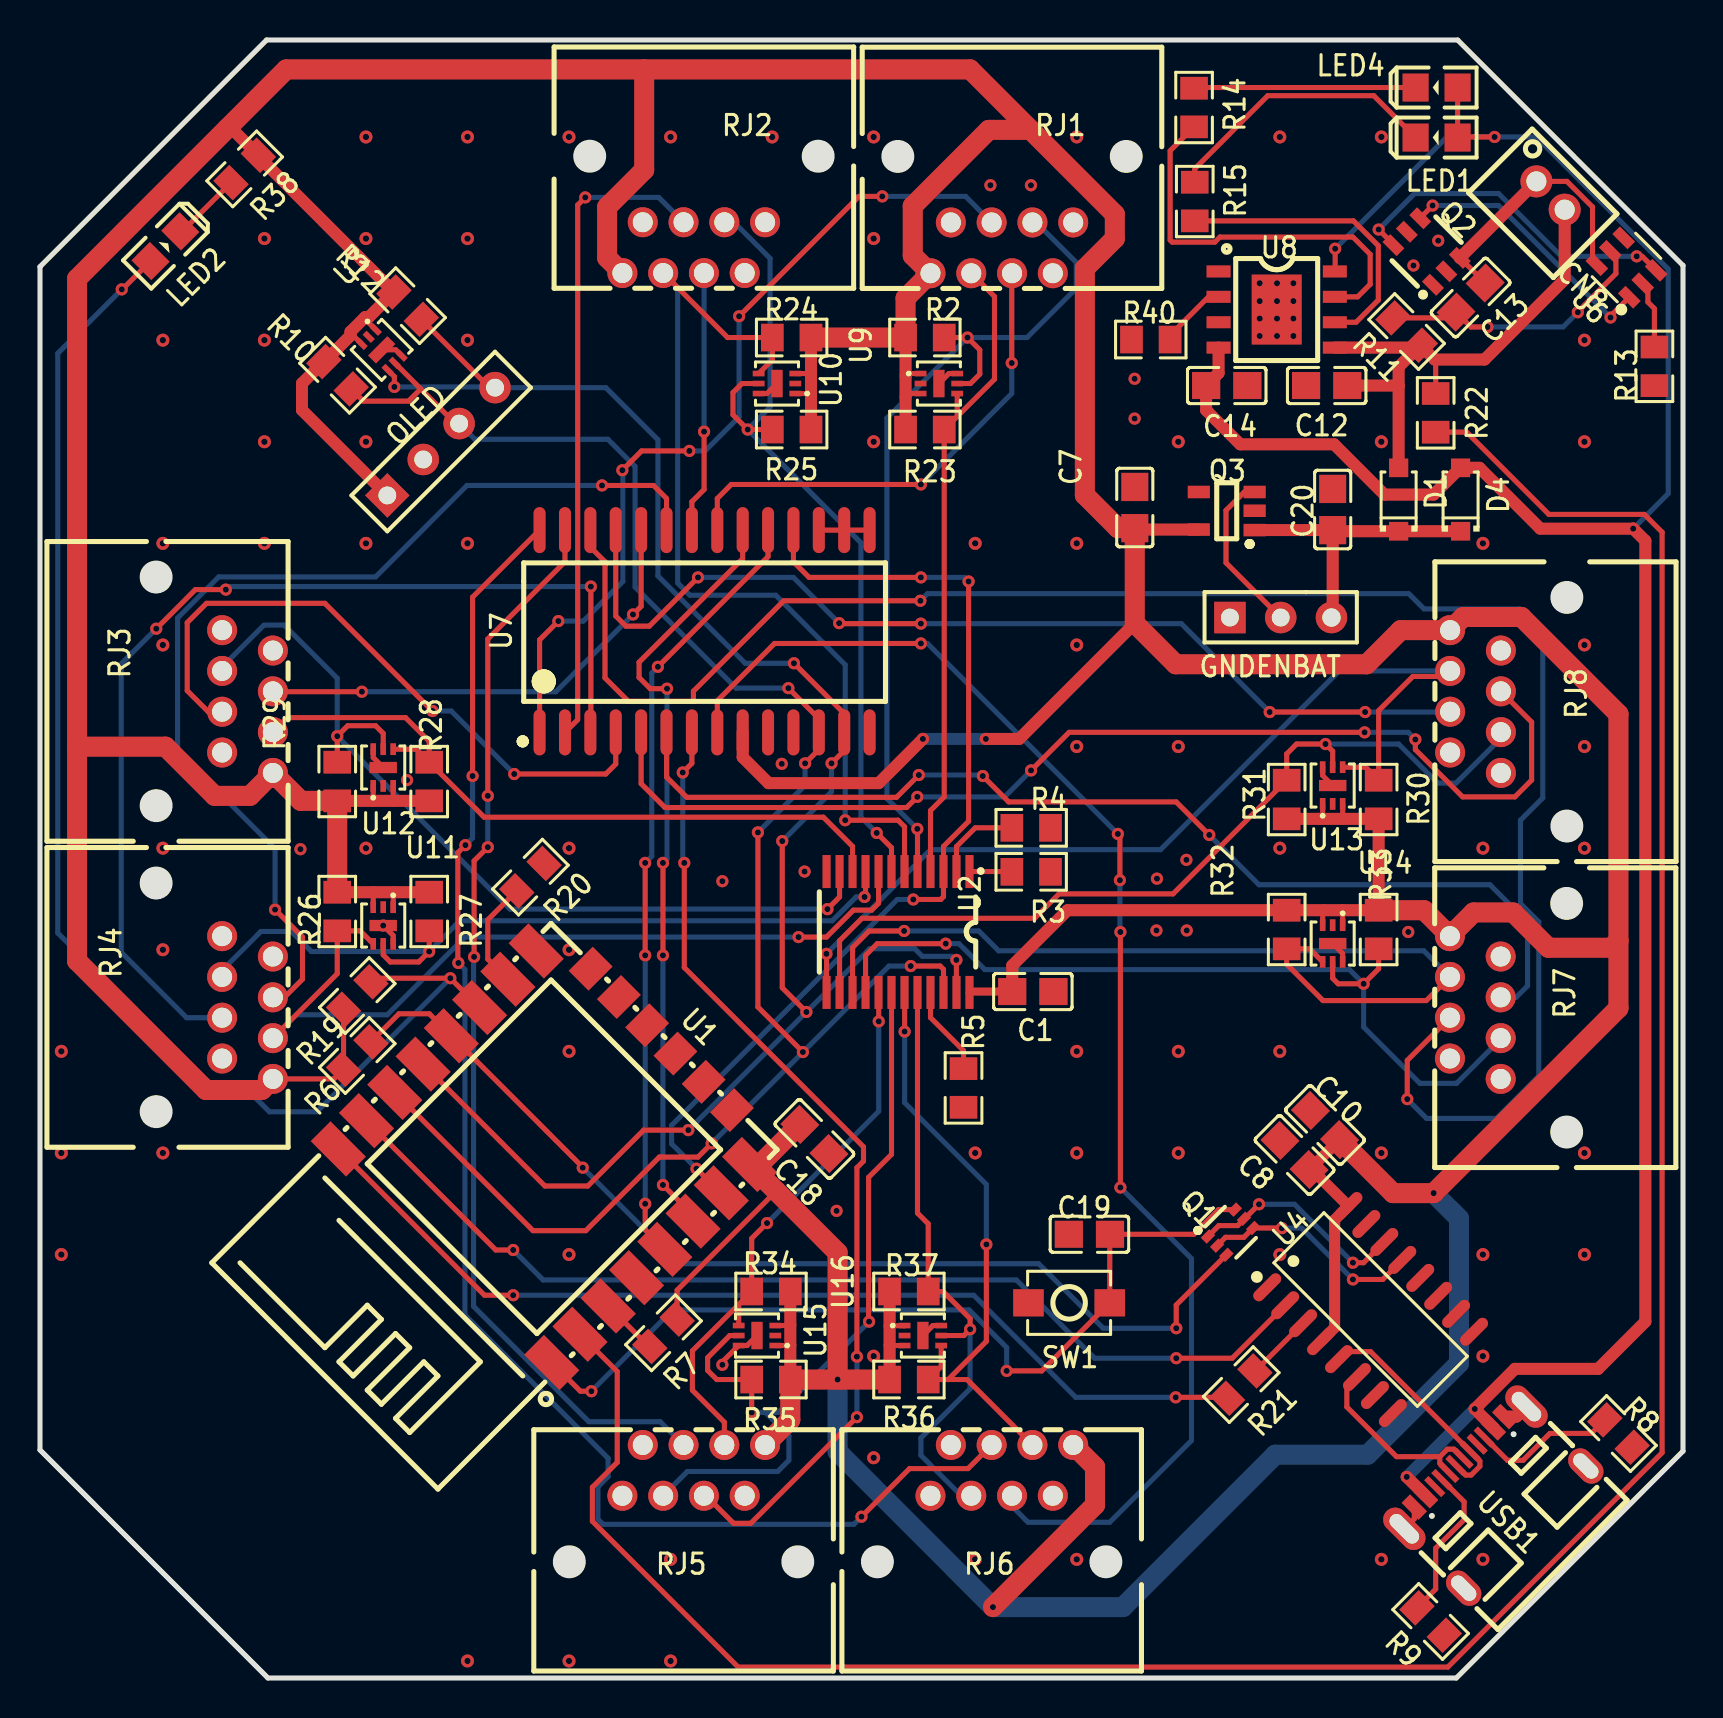
[diagram p4: board, top side]
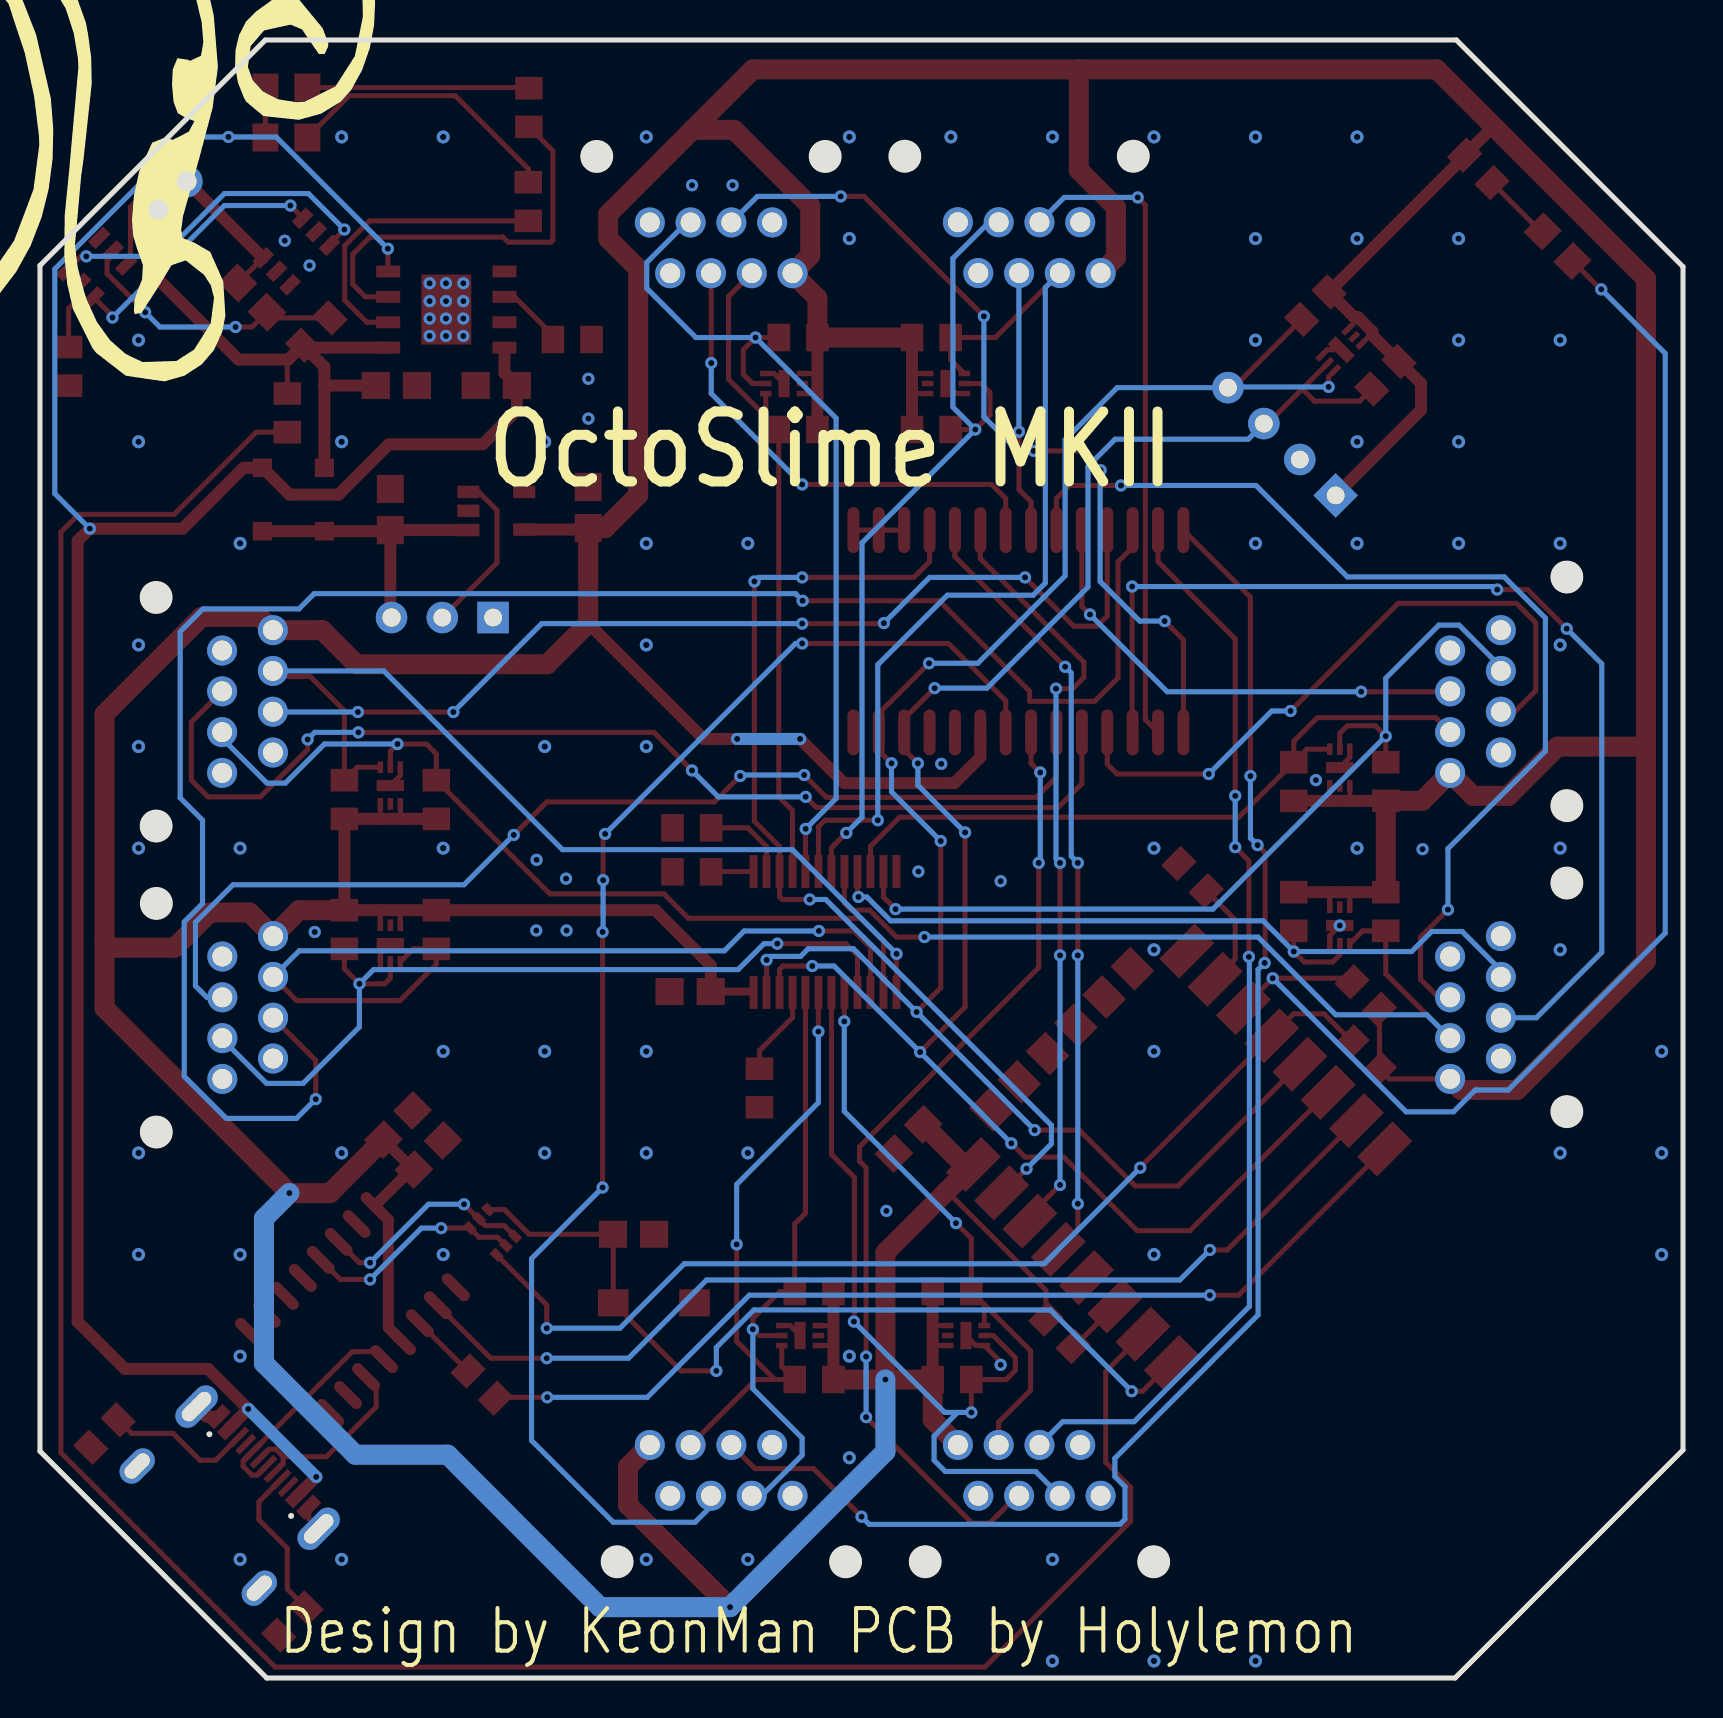
[diagram p5: board, bottom side, seen from below]

Outline 82.2 x 81.9 mm; copper layers: Top Layer, Bottom Layer. Coordinates in mm from the lower left corner of the outline.
Outline path: 0,70.56 11.34,81.9 70.92,81.9 82.2,70.62 82.2,11.34 70.86,0 11.4,0 0,11.4 0,70.56
Stack: Top Layer 0.035mm / Dielectric1 1.51mm FR4 er 4.5 / Bottom Layer 0.035mm

## Design rules (mm)
spacing Default (default): track to track 0.152, other pairs 0 to 0.152
track width Default (default): min 0.254, default 0.254, max 25.4
differential pair differentialPair (default): width min 0.127, default 0.254, max 2.54; gap min 0.152, default 0.152
via Default (default): diameter min 0.61, default 0.61, max 100.025; hole min 0.305, default 0.305, max 59.995

## Placement (name value [footprint] x y rotation side)
C1  10uF  [C0805]  49.67 34.32 0 top
C7  10u  [C0805]  54.77 58.52 90 top
C8  10uF  [C0805]  62.76 26.15 135 top
C10  100nF  [C0805]  64.29 27.65 135 top
C12  10uF  [C0805]  64.37 64.62 180 top
C13  100nF  [C0805]  71.57 69.02 45 top
C14  10uf  [C0805]  59.37 64.62 0 top
C18  100nf  [C0805]  38.74 26.95 315 top
C19  100nf  [C0805]  52.5 22.19 180 top
C20  10u  [C0805]  64.67 58.42 90 top
CN8  B2B-PH-K-S(LF)(SN)  [CONN-TH_B2B-PH-K-S]  75.57 74.12 135 top
D1  SM5817PL-TP X 2  [SOD-123FL_L2.8-W1.7-LS3.6-RD]  67.97 58.92 90 top
D4  SM5817PL-TP X 2  [SOD-123FL_L2.8-W1.7-LS3.6-RD]  71.07 58.92 90 top
GNDENBAT  HDR-F-2.54_1x3  [HDR-F-2.54_1X3]  62.07 53.02 0 top
LED1  LED-0805_B  [LED0805_BLUE]  69.87 77.02 180 top
LED2  LED-0805_B  [LED0805_BLUE]  6.27 71.59 45 top
LED4  LED-0805_R  [LED0805_RED]  69.87 79.52 180 top
OLED  OLED  [HDR-M-2.54_1X4]  20.07 61.82 45 top
Q1  UMH3N  [SC-70-6_L2.2-W1.3-P0.65-LS2.1-BR]  59.56 22.29 225 top
Q2  FS8205  [SOT-23-6_L2.9-W1.6-P0.95-LS2.8-BR]  69.37 71.32 315 top
Q3  XC6220B331MR-G  [SOT-25-5_L3.0-W1.8-P0.95-LS3.0-BR]  59.37 58.35 0 top
R2  10k  [R0805]  44.27 67.02 0 top
R3  10k  [R0805]  49.59 40.31 0 top
R4  10k  [R0805]  49.59 42.51 0 top
R5  10k  [R0805]  46.2 29.5 90 top
R6  12K  [R0805]  15.87 31.12 45 top
R7  10k  [R0805]  31.19 17.26 225 top
R8  5.1k  [R0805]  78.97 12.22 135 top
R9  5.1k  [R0805]  69.57 2.82 315 top
R10  10k  [R0805]  14.89 65.14 315 top
R11  100  [R0805]  68.37 67.32 315 top
R12  10k  [R0805]  18.39 68.62 315 top
R13  1k  [R0805]  80.77 65.58 270 top
R14  1k  [R0805]  57.74 78.52 270 top
R15  1k  [R0805]  57.77 73.82 270 top
R19  12K  [R0805]  15.87 34.12 45 top
R20  12k  [R0805]  24.54 40.04 225 top
R21  470  [R0805]  60.1 14.67 45 top
R22  180k  [R0805]  69.83 63.26 270 top
R23  10k  [R0805]  44.27 62.42 0 top
R24  10k  [R0805]  37.61 67.02 180 top
R25  10k  [R0805]  37.61 62.42 180 top
R26  10k  [R0805]  14.87 38.32 270 top
R27  10k  [R0805]  19.47 38.32 270 top
R28  10k  [R0805]  19.47 44.82 90 top
R29  10k  [R0805]  14.87 44.82 90 top
R30  10k  [R0805]  66.97 43.92 90 top
R31  10k  [R0805]  62.37 43.92 90 top
R32  10k  [R0805]  62.37 37.42 270 top
R33  10k  [R0805]  66.97 37.42 270 top
R34  10k  [R0805]  36.57 19.32 180 top
R35  10k  [R0805]  36.57 14.92 180 top
R36  10k  [R0805]  43.47 14.92 0 top
R37  10k  [R0805]  43.47 19.32 0 top
R38  2k  [R0805]  10.24 75.45 45 top
R40  1.5kΩ  [R0805]  55.57 66.92 0 top
RJ1  R-RJ45R08P-A009  [RJ45-TH_R-RJ45R08P-A009]  48.12 71.51 180 top
RJ2  R-RJ45R08P-A009  [RJ45-TH_R-RJ45R08P-A009]  32.71 71.52 180 top
RJ3  R-RJ45R08P-A009  [RJ45-TH_R-RJ45R08P-A009]  10.38 48.82 270 top
RJ4  R-RJ45R08P-A009  [RJ45-TH_R-RJ45R08P-A009]  10.38 33.52 270 top
RJ5  R-RJ45R08P-A009  [RJ45-TH_R-RJ45R08P-A009]  32.71 10.38 0 top
RJ6  R-RJ45R08P-A009  [RJ45-TH_R-RJ45R08P-A009]  48.12 10.38 0 top
RJ7  R-RJ45R08P-A009  [RJ45-TH_R-RJ45R08P-A009]  71.81 33.52 90 top
RJ8  R-RJ45R08P-A009  [RJ45-TH_R-RJ45R08P-A009]  71.82 48.82 90 top
SW1  -  [SW-SMD_L4.0-W2.9-LS5.0]  51.49 18.76 180 top
U1  ESP-12F(ESP8266MOD)  [WIFIM-SMD_ESP-12F-ESP8266MOD]  25.67 26.52 45 top
U2  TCA9548APWR  [TSSOP-24_L7.8-W4.4-P0.65-LS6.4-BL]  42.93 37.3 180 top
U3  LTC4311IDC#TRPBF  [DFN-6_L2.0-W2.0-P0.50-BL-EP]  17.1 66.41 225 top
U4  CH340C  [SOP-16_L10.0-W3.9-P1.27-LS6.0-BL]  66.57 18.42 315 top
U6  DW01A  [SOT-23-6_L2.9-W1.6-P0.95-LS2.8-BL]  79.37 70.52 45 top
U7  -  [SOIC-28_L18.0-W7.5-P1.27-LS10.3-BL]  33.25 52.34 0 top
U8  TP4056  [ESOP-8_L4.9-W3.9-P1.27-LS6.0-BL-EP]  61.87 68.42 270 top
U9  LTC4311IDC#TRPBF  [DFN-6_L2.0-W2.0-P0.50-BL-EP]  44.97 64.72 270 top
U10  LTC4311IDC#TRPBF  [DFN-6_L2.0-W2.0-P0.50-BL-EP]  36.87 64.72 90 top
U11  LTC4311IDC#TRPBF  [DFN-6_L2.0-W2.0-P0.50-BL-EP]  17.17 37.62 180 top
U12  LTC4311IDC#TRPBF  [DFN-6_L2.0-W2.0-P0.50-BL-EP]  17.17 45.52 0 top
U13  LTC4311IDC#TRPBF  [DFN-6_L2.0-W2.0-P0.50-BL-EP]  64.67 44.62 0 top
U14  LTC4311IDC#TRPBF  [DFN-6_L2.0-W2.0-P0.50-BL-EP]  64.67 36.72 180 top
U15  LTC4311IDC#TRPBF  [DFN-6_L2.0-W2.0-P0.50-BL-EP]  35.87 17.12 90 top
U16  LTC4311IDC#TRPBF  [DFN-6_L2.0-W2.0-P0.50-BL-EP]  44.17 17.12 270 top
USB1  MC-107DM  [USB-C-SMD_MC-107D]  72.65 9.18 45 top

## Footprints (pads in the part's own frame, mm; a bottom-side part is the same pattern mirrored in y, then rotated)
C0805
  rect 1.41x1.35 smd: 1(-1.03,0) 2(1.03,0)
CONN-TH_B2B-PH-K-S
  round 1.6 hole 1: 1(1,0) 2(-1,0)
DFN-6_L2.0-W2.0-P0.50-BL-EP
  rect 0.28x0.585 smd: 1(-0.5,-0.917) 2(0,-0.917) 3(0.5,-0.917) 4(0.5,0.917) 5(0,0.917) 6(-0.5,0.917)
  rect 1.37x0.56 smd: 7(0,0)
ESOP-8_L4.9-W3.9-P1.27-LS6.0-BL-EP
  rect 0.6x1.2 smd: 1(-1.905,-2.909) 2(-0.635,-2.909) 3(0.635,-2.909) 4(1.905,-2.909) 5(1.905,2.909) 6(0.635,2.909) 7(-0.635,2.909) 8(-1.905,2.909)
  rect 3.5x2.5 smd: 9(0,0)
HDR-F-2.54_1X3
  rect 1.575x1.575 hole 0.889: 1(-2.54,0)
  round 1.575 hole 0.889: 2(0,0)
  round 1.575 hole 0.914: 3(2.54,0)
HDR-M-2.54_1X4
  rect 1.575x1.575 hole 0.889: 1(-3.81,0)
  round 1.575 hole 0.889: 2(-1.27,0) 3(1.27,0) 4(3.81,0)
LED0805_BLUE
  rect 1.3x1.399 smd: 1(-1.05,0) 2(1.05,0)
LED0805_RED
  rect 1.3x1.399 smd: 1(-1.05,0) 2(1.05,0)
R0805
  rect 1.133x1.377 smd: 1(-0.966,0) 2(0.966,0)
RJ45-TH_R-RJ45R08P-A009
  round 1.5 hole 1: 1(3.57,1.27) 2(2.55,-1.27) 3(1.53,1.27) 4(0.51,-1.27) 5(-0.51,1.27) 6(-1.53,-1.27) 7(-2.55,1.27) 8(-3.57,-1.27)
SC-70-6_L2.2-W1.3-P0.65-LS2.1-BR
  rect 0.6x0.42 smd: 1(0.95,-0.65) 2(0.95,0) 3(0.95,0.65) 4(-0.95,0.65) 5(-0.95,0) 6(-0.95,-0.65)
SOD-123FL_L2.8-W1.7-LS3.6-RD
  rect 0.93x0.96 smd: 1(-1.585,0) 2(1.585,0)
SOIC-28_L18.0-W7.5-P1.27-LS10.3-BL
  oval 0.6x2.3 smd: 1(-8.255,-5.058) 2(-6.985,-5.058) 3(-5.715,-5.058) 4(-4.445,-5.058) 5(-3.175,-5.058) 6(-1.905,-5.058) 7(-0.635,-5.058) 8(0.635,-5.058) 9(1.905,-5.058) 10(3.175,-5.058) 11(4.445,-5.058) 12(5.715,-5.058) 13(6.985,-5.058) 14(8.255,-5.058) 15(8.255,5.058) 16(6.985,5.058) 17(5.715,5.058) 18(4.445,5.058) 19(3.175,5.058) 20(1.905,5.058) 21(0.635,5.058) 22(-0.635,5.058) 23(-1.905,5.058) 24(-3.175,5.058) 25(-4.445,5.058) 26(-5.715,5.058) 27(-6.985,5.058) 28(-8.255,5.058)
SOP-16_L10.0-W3.9-P1.27-LS6.0-BL
  oval 0.56x1.745 smd: 1(-4.445,-2.873) 2(-3.175,-2.873) 3(-1.905,-2.873) 4(-0.635,-2.873) 5(0.635,-2.873) 6(1.905,-2.873) 7(3.175,-2.873) 8(4.445,-2.873) 9(4.445,2.873) 10(3.175,2.873) 11(1.905,2.873) 12(0.635,2.873) 13(-0.635,2.873) 14(-1.905,2.873) 15(-3.175,2.873) 16(-4.445,2.873)
SOT-23-6_L2.9-W1.6-P0.95-LS2.8-BL
  rect 0.532x1.072 smd: 1(-0.95,-1.149) 2(0,-1.149) 3(0.95,-1.149) 4(0.95,1.149) 5(0,1.149) 6(-0.95,1.149)
SOT-23-6_L2.9-W1.6-P0.95-LS2.8-BR
  rect 1x0.55 smd: 1(1.4,-0.95) 2(1.4,0) 3(1.4,0.95) 4(-1.4,0.95) 5(-1.4,0) 6(-1.4,-0.95)
SOT-25-5_L3.0-W1.8-P0.95-LS3.0-BR
  rect 1.105x0.623 smd: 1(1.397,-0.953) 2(1.397,0.013) 3(1.397,0.953) 4(-1.397,0.953) 5(-1.397,-0.927)
SW-SMD_L4.0-W2.9-LS5.0
  rect 1.529x1.359 smd: 1(-2.034,0) 2(2.034,0)
TSSOP-24_L7.8-W4.4-P0.65-LS6.4-BL
  rect 0.4x1.65 smd: 1(-3.575,-3.022) 2(-2.925,-3.022) 3(-2.275,-3.022) 4(-1.625,-3.022) 5(-0.975,-3.022) 6(-0.325,-3.022) 7(0.325,-3.022) 8(0.975,-3.022) 9(1.625,-3.022) 10(2.275,-3.022) 11(2.925,-3.022) 12(3.575,-3.022) 13(3.575,3.022) 14(2.925,3.022) 15(2.275,3.022) 16(1.625,3.022) 17(0.975,3.022) 18(0.325,3.022) 19(-0.325,3.022) 20(-0.975,3.022) 21(-1.625,3.022) 22(-2.275,3.022) 23(-2.925,3.022) 24(-3.575,3.022)
USB-C-SMD_MC-107D
  oval 1.2x2.5 hole 0.7x1.8: 0(-4.32,1.892) 2(4.32,1.892)
  oval 1.2x2 hole 0.7x1.5: 1(-4.32,-2.308) 3(4.32,-2.308)
  rect 0.6x1.2 smd: A1B12(-3.2,2.308) A4B9(-2.4,2.308) B1A12(3.2,2.308) B4A9(2.4,2.308)
  rect 0.3x1.2 smd: A5(-1.25,2.308) A6(-0.25,2.308) A7(0.25,2.308) A8(1.25,2.308) B5(1.75,2.308) B6(0.75,2.308) B7(-0.75,2.308) B8(-1.75,2.308)
WIFIM-SMD_ESP-12F-ESP8266MOD
  rect 1.4x2.5 smd: 1(-7.651,-7.551) 2(-5.651,-7.551) 3(-3.651,-7.551) 4(-1.651,-7.551) 5(0.349,-7.551) 6(2.349,-7.551) 7(4.349,-7.551) 8(6.349,-7.551) 9(6.349,7.549) 10(4.349,7.55) 11(2.349,7.551) 12(0.349,7.551) 13(-1.651,7.55) 14(-3.651,7.551) 15(-5.651,7.551) 16(-7.651,7.551)
  rect 1.7x1.4 smd: 17(7.651,-5) 18(7.649,-3.002) 19(7.649,-1.004) 20(7.649,0.998) 21(7.649,2.997) 22(7.651,4.997)

## Nets
As in the schematic, except:
3.3V: C1.1 C7.1 C8.1 C10.1 C18.1 OLED.1 Q3.5 R2.1 R6.1 R7.1 R10.1 R12.1 R19.1 R23.1 R24.1 R25.1 R26.1 R27.1 R28.1 R29.1 R30.1 R31.1 R32.1 R33.1 R34.1 R35.1 R36.1 R37.1 R38.2 RJ1.1 RJ2.1 RJ3.1 RJ4.1 RJ5.1 RJ6.1 RJ7.1 RJ8.1 U1.8 U2.24 U3.1 U3.3 U4.4 U4.16 U7.9 U9.1 U9.3 U10.1 U10.3 U11.1 U11.3 U12.1 U12.3 U13.1 U13.3 U14.1 U14.3 U15.1 U15.3 U16.1 U16.3
GND: C1.2 C7.2 C8.2 C10.2 C12.2 C14.2 C18.2 C19.2 C20.2 GNDENBAT.1 OLED.2 Q2.1 Q3.2 R3.2 R4.2 R5.1 R8.1 R9.2 R13.2 R20.1 R40.1 RJ1.8 RJ2.8 RJ3.8 RJ4.8 RJ5.8 RJ6.8 RJ7.8 RJ8.8 SW1.2 U1.9 U2.12 U3.6 U3.7 U4.1 U7.10 U8.1 U8.3 U8.9 U9.6 U9.7 U10.6 U10.7 U11.6 U11.7 U12.6 U12.7 U13.6 U13.7 U14.6 U14.7 U15.6 U15.7 U16.6 U16.7 USB1.0 USB1.1 USB1.2 USB1.3 USB1.A1B12 USB1.B1A12
OUT+: C20.1 D1.1 D4.1 GNDENBAT.3 Q3.1
SCL: OLED.3 R10.2 U1.14 U2.22 U3.5 U7.12
SDA: OLED.4 R12.2 U1.13 U2.23 U3.4 U7.13
$3N426: GNDENBAT.2 Q3.3

Pads without a net: Q2 2 5; Q3 4; RJ1 2 7; RJ2 2 7; RJ3 2 7; RJ4 2 7; RJ5 2 7; RJ6 2 7; RJ7 2 7; RJ8 2 7; U1 4 17 18 19 20 21 22; U3 2; U4 7 8 9 10 11 12 15; U6 4; U7 11 14; U9 2; U10 2; U11 2; U12 2; U13 2; U14 2; U15 2; U16 2; USB1 A8 B8

## Via types
v1: diameter 0.61, hole 0.305, Top Layer to Bottom Layer, 156 vias
v2: diameter 0.65, hole 0.32, Top Layer to Bottom Layer, 72 vias

## Routing (per net, layer and track width the routed paths; a pad name or vN(x,y) marks a point on that pad's centre or on a via; arc(x,y) is an arc through that point)
3.3V: length 496.2
  Top Layer w0.254: 65.16,42.96 65.17,42.97 U13.3 ; 36.83,24.35 31.88,19.39 R7.1 ; U16.1 43.25,17.62 42.52,17.62 42.51,17.6 ; U14.1 65.17,38.38 65.16,38.39 ; R19.1 R6.1 14.7,29.95 RJ4.1 ; U16.3 42.52,16.62 42.51,16.64 ; U10.1 38.55,64.22 38.57,64.2 ; U15.1 37.51,16.62 37.54,16.65 ; U14.3 64.17,38.35 64.22,38.39 ; 43.31,64.06 43.47,64.22 U9.3 ; U9.1 43.42,65.22 43.31,65.11 ; U11.1 17.68,38.55 17.68,39.29 ; 16.67,39.29 16.67,39.29 U11.3 ; 16.09,66.7 15.67,67.12 15.53,67.12 ; 16.45,68.04 16.45,67.76 U3.1 ; U13.1 64.17,43.13 64,42.96 ; U10.3 38.48,65.22 38.57,65.13 ; 16.67,43.86 U12.1 ; U15.3 37.5,17.62 37.54,17.66 ; 17.67,43.86 U12.3
  Top Layer w0.4: U2.24 46.55,34.32 C1.1
  Top Layer w0.55: U4.4 64.77,17.52 64.77,22.91 U4.16 63.64,25.42 63.52,25.42 C10.1
  Top Layer w0.6: Q3.5 54.84,57.42 ; R26.1 R27.1 ; 54.77,52.74 48.99,46.95 v1(47.32,46.95) ; R36.1 R37.1 ; R28.1 R29.1 ; R2.1 R23.1 ; R34.1 R35.1 ; v1(44.17,46.95) 41.96,44.74 36.45,44.74 35.16,46.04 U7.9 ; R31.1 R30.1 R33.1 R32.1 51.41,38.39 48.64,35.62 C1.1 ; OLED.1 13.11,63.4 13.11,64.73 R10.1 14.23,65.82 15.53,67.12 15.53,67.31 16.27,68.04 16.45,68.04 R12.1 10.92,76.09 R38.2 9.58,77.48 9.37,77.48 ; R25.1 R24.1
  Top Layer w1: v1(39.9,14.92) R35.1 37.54,12.91 RJ5.1 ; v1(39.9,14.92) 39.9,21.27 U1.8 36.01,25.67 C18.1 ; v1(39.9,14.92) R36.1 ; 1.86,46.57 1.86,35.85 8.31,29.4 11.1,29.4 RJ4.1 ; 1.86,46.57 6.28,46.57 8.74,44.11 10.51,44.11 RJ3.1 13.05,43.86 R29.1 R26.1 ; 1.86,46.57 1.86,69.97 12.32,80.43 30.22,80.43 ; 49.56,77.41 53.77,73.19 53.77,71.97 52.27,70.47 52.27,59.14 53.93,57.49 C7.1 54.77,52.74 56.82,50.69 66.37,50.69 68.08,52.39 RJ8.1 71.2,53.05 74.12,53.05 78.97,48.2 78.97,36.86 ; 49.56,77.41 46.53,80.43 30.22,80.43 ; 49.56,77.41 47.47,77.41 43.66,73.6 43.66,71.12 RJ1.1 43.31,68.99 R2.1 R24.1 ; R33.1 69.24,38.39 RJ7.1 71.72,38.28 73.7,38.28 75.46,36.51 78.62,36.51 78.97,36.86 ; C10.1 67.69,24.25 v1(69.72,24.25) 78.97,33.49 78.97,36.86 ; 30.22,80.43 30.23,80.42 30.23,75.4 28.37,73.55 28.37,71.01 RJ2.1 ; RJ6.1 52.78,10.56 52.78,8.65 v1(47.68,3.54)
  Bottom Layer w0.6: v1(47.32,46.95) v1(44.17,46.95)
  Bottom Layer w1: v1(39.9,14.92) 39.9,11.32 v1(47.68,3.54) 54.18,3.54 61.8,11.16 66.42,11.16 70.99,15.74 70.99,22.98 v1(69.72,24.25)
+5V: length 126.9
  Top Layer w0.254: v1(64.8,71.46) 64.8,70.35 U8.8 ; LED4.1 LED1.1 70.95,77.05 v1(72.77,77.05)
  Top Layer w0.6: USB1.A4B9 v1(68.38,10.05) ; 71.06,60.51 69.72,59.17 67.26,59.17 64.75,61.68 60.05,61.68 58.34,63.39 C14.1 58.96,65.25 U8.4 ; D4.2 72.02,60.51 75.06,57.47 v1(79.71,57.47) 80.32,56.86 80.32,17.82 77.95,15.46 73.79,15.46 v1(71.78,13.45) 72.72,12.52 USB1.B4A9
  Bottom Layer w0.254: v1(64.8,71.46) 70.38,77.05 v1(72.77,77.05) 74.85,77.05 81.46,70.45 81.46,59.22 v1(79.71,57.47)
  Bottom Layer w0.6: v1(68.38,10.05) 71.77,13.45 v1(71.78,13.45)
GND: length 14
  Top Layer w0.254: U10.6 36.37,64.22 U10.7 ; U15.7 35.37,16.62 U15.6 34.14,15.81 v1(34.14,15.66) ; U16.7 44.67,17.62 U16.6 ; U3.7 17.8,66.41 U3.6 ; U9.6 45.47,65.22 U9.7 ; U12.6 16.67,46.02 U12.7 ; v1(17.17,37.62) 17.67,37.12 U11.6 ; U14.7 65.17,36.22 U14.6 ; USB1.0 68.75,7.96 USB1.A1B12 ; U13.7 64.17,45.12 U13.6
  Top Layer w0.6: USB1.B1A12 73.87,13.07 74.37,13.57
  vias: v1(13.03,41.44) v1(18.37,44.9) v1(34.14,39.84) v1(37.11,45.71) v1(38.25,40.32) v1(39.85,23.36) v1(47.55,74.64) v1(49.58,74.64) v1(54.76,64.96) v1(54.76,62.97) v1(55.88,39.97) v1(55.86,37.38) v1(57.35,40.91) v1(57.37,37.38) v1(61.02,69.74) v1(61.02,68.85) v1(61.02,67.97) v1(61.02,67.1) v1(61.89,69.74) v1(61.89,68.85) v1(61.89,67.97) v1(61.89,67.1) v1(62.71,69.74) v1(62.71,68.85) v1(62.71,67.97) v1(62.71,67.1) v1(68.45,37.3) v1(68.71,70.62) v1(69.95,71.86) v2(1.07,31.33) v2(1.07,26.25) v2(1.07,21.17) v2(6.15,66.89) v2(6.15,56.73) v2(6.15,51.65) v2(6.15,41.49) v2(6.15,36.41) v2(6.15,26.25) v2(11.23,71.97) v2(11.23,66.89) v2(11.23,61.81) v2(11.23,56.73) v2(16.31,77.05) v2(16.31,71.97) v2(16.31,61.81) v2(16.31,56.73) v2(16.31,41.49) v2(21.39,77.05) v2(21.39,71.97) v2(21.39,66.89) v2(21.39,56.73) v2(21.39,0.85) v2(26.47,77.05) v2(26.47,41.49) v2(26.47,36.41) v2(26.47,31.33) v2(26.47,21.17) v2(26.47,0.85) v2(31.55,77.05) v2(31.55,5.93) v2(31.55,0.85) v2(36.63,77.05) v2(41.71,77.05) v2(41.71,71.97) v2(41.71,61.81) v2(41.71,16.09) v2(41.71,11.01) v2(46.79,56.73) v2(46.79,26.25) v2(46.79,5.93) v2(51.87,77.05) v2(51.87,56.73) v2(51.87,51.65) v2(51.87,46.57) v2(51.87,31.33) v2(51.87,26.25) v2(51.87,5.93) v2(56.95,61.81) v2(56.95,46.57) v2(56.95,31.33) v2(56.95,26.25) v2(62.03,77.05) v2(62.03,41.49) v2(62.03,31.33) v2(62.03,21.17) v2(67.11,77.05) v2(67.11,61.81) v2(67.11,26.25) v2(67.11,5.93) v2(72.19,56.73) v2(72.19,41.49) v2(72.19,21.17) v2(72.19,16.09) v2(72.19,5.93) v2(77.27,66.89) v2(77.27,61.81) v2(77.27,51.65) v2(77.27,46.57) v2(77.27,41.49) v2(77.27,26.25) v2(77.27,21.17)
A0: length 2.5
  Top Layer w0.254: U7.15 U7.16 U7.17
B+: length 27.6
  Top Layer w0.254: 69.83,65.87 R22.1
  Top Layer w0.6: 68.93,66.52 R11.2 69.77,65.92 72.27,65.92 76.28,69.93 CN8.2 ; 68.93,66.52 U8.5 ; 68.93,66.52 67.97,65.56 67.97,64.61 ; C12.1 67.96,64.62 67.97,64.61 ; 67.97,64.61 D1.2
B-: length 13.5
  Top Layer w0.254: U6.6 77.67,70.88 77.67,73.55 76.39,74.83 CN8.1 ; C13.2 71.05,71.01
  Top Layer w0.6: CN8.1 71.04,71.01 Q2.3
CHRG#: length 20.2
  Top Layer w0.254: R14.2 56.54,76.36 56.54,71.9 56.64,71.79 58.78,71.79 59.03,72.05 65.69,72.05 66.55,71.18 66.55,69.69 65.92,69.06 U8.7
D5: length 38.9
  Top Layer w0.254: U1.5 30.28,22.41 v1(30.28,23.71) ; v1(30.28,36.13) v1(30.28,40.76) ; v1(30.91,50.56) 36.42,56.07 U7.19
  Bottom Layer w0.254: v1(30.28,23.71) v1(30.28,36.13) ; v1(30.91,50.56) 30.61,50.25 30.61,41.09 v1(30.28,40.76)
D6: length 38.5
  Top Layer w0.254: v1(31.17,24.65) 32.67,23.15 32.67,22.85 ; v1(31.37,49.47) 30.53,49.47 29.97,50.03 29.97,50.79 35.16,55.97 U7.20 ; v1(31.17,36.13) v1(31.17,40.76)
  Bottom Layer w0.254: v1(31.17,40.76) 31.37,40.96 v1(31.37,49.47) ; v1(31.17,24.65) v1(31.17,36.13)
D7: length 49.8
  Top Layer w0.254: U7.18 37.69,55.81 38.48,55.03 v1(44.07,55.03) ; v1(43.69,38.93) 45.06,38.93 45.2,39.07 U2.3 45.2,41.58 46.46,42.84 v1(46.46,54.83) ; v1(32.84,25.46) 34.05,24.26 U1.7
  Bottom Layer w0.254: v1(43.69,38.93) 42.89,38.93 31.6,27.64 31.6,26.71 v1(32.84,25.46) ; v1(44.07,55.03) 46.25,55.03 v1(46.46,54.83)
D+: length 11.3
  Top Layer w0.254: U4.5 65.37,16.32 66.57,16.32 USB1.B6 72.04,10.85 72.04,10.58 71.6,10.15 71.33,10.15 USB1.A6
D-: length 9.9
  Top Layer w0.254: 70.03,11.07 67.87,11.07 65.38,13.55 65.38,14.54 U4.6 ; 70.03,11.07 70.41,11.44 70.74,11.44 USB1.A7 ; 70.03,11.07 70.03,10.73 USB1.B7
DTR: length 11.1
  Top Layer w0.254: v1(62.13,22.49) 62.12,22.5 Q1.4 60.23,22.04 59.31,22.04 Q1.2 ; v1(65.69,19.93) 67.18,19.93 U4.13
  Bottom Layer w0.254: v1(65.69,19.93) 63.12,22.49 v1(62.13,22.49)
GPA0: length 24.5
  Top Layer w0.254: v1(48.62,65.75) 48.62,70.22 RJ1.5 ; v1(44.07,59.68) 34.59,59.68 33.88,58.98 U7.21
  Bottom Layer w0.254: v1(48.62,65.75) 48.62,64.22 v1(44.07,59.68)
GPA1: length 13.1
  Top Layer w0.254: v1(33.22,62.32) 33.22,59.42 32.62,58.81 U7.22
  Bottom Layer w0.254: v1(33.22,62.32) 33.22,70.24 RJ2.5
GPA2: length 51.6
  Top Layer w0.254: v1(28.12,59.63) 30.69,59.63 31.34,58.98 U7.23 ; RJ4.5 12.23,34.03 13.13,34.94 13.13,37.05 v1(11.76,38.42)
  Bottom Layer w0.254: v1(28.12,59.63) 21.36,59.63 16.79,55.06 8.94,55.06 6.88,53 6.88,46.34 11.76,41.47 v1(11.76,38.42)
GPA3: length 24
  Top Layer w0.254: U7.24 30.07,53.58 v1(29.67,53.18) ; v1(16.1,49.31) 11.67,49.31 RJ3.5
  Bottom Layer w0.254: v1(16.1,49.31) 25.81,49.31 v1(29.67,53.18)
GPA4: length 50.1
  Top Layer w0.254: v1(32.92,55.03) 30.48,52.59 29.31,52.59 28.81,53.1 U7.25 ; v1(61.52,48.3) v1(66.29,48.3) ; v1(44.07,52.72) 40.01,52.72 v1(39.98,52.74)
  Bottom Layer w0.254: v1(32.92,55.03) 37.69,55.03 v1(39.98,52.74) ; RJ8.5 70.53,48.3 v1(66.29,48.3) ; v1(44.07,52.72) 57.1,52.72 v1(61.52,48.3)
GPA5: length 94.3
  Top Layer w0.254: U7.26 27.53,56.55 28.27,55.81 28.27,50.01 29.44,48.83 32.69,48.83 32.69,49.34 37.21,53.86 v1(44.04,53.86) ; v1(68.4,28.94) 68.4,30.88 RJ7.5
  Bottom Layer w0.254: v1(44.04,53.86) 44.4,54.22 68.48,54.22 69.24,53.46 74.04,53.46 75.19,52.31 75.19,44.01 74.07,42.89 74.07,38.72 74.98,37.81 74.98,30.09 72.87,27.98 69.37,27.98 v1(68.4,28.94)
GPA6: length 54.1
  Top Layer w0.254: v1(22.4,44.11) 22.4,51.95 26.26,55.81 U7.27 ; v1(21.72,36.06) 21.72,40.86 v1(22.4,41.54)
  Bottom Layer w0.254: v1(22.4,44.11) v1(22.4,41.54) ; RJ5.5 31.03,12.81 27.46,12.81 21.69,18.58 21.69,36.03 v1(21.72,36.06)
GPA7: length 75.9
  Top Layer w0.254: U7.28 21.64,54.04 v1(21.64,45.1) ; RJ6.5 46.43,10.47 43.5,10.47 v1(41.1,8.06) ; v1(20.93,35.75) 20.91,35.78 20.91,41.26 v1(21.29,41.64)
  Bottom Layer w0.254: v1(41.1,8.06) 40.72,7.68 28.17,7.68 27.92,7.94 27.92,9.56 28.42,10.07 28.42,10.99 21.26,18.15 21.26,35.42 v1(20.93,35.75) ; v1(21.64,45.1) 21.64,42 v1(21.29,41.64)
GPB0: length 43.2
  Top Layer w0.254: v1(32.49,61.35) 30.1,61.35 v1(29.13,60.39) ; v1(25.93,52.85) 25,51.91 U7.1 ; v1(34.98,68.09) 40.97,74.08 v1(42.14,74.08)
  Bottom Layer w0.254: v1(32.49,61.35) 33.28,61.35 34.98,63.06 v1(34.98,68.09) ; v1(25.93,52.85) 27.18,52.85 29.16,54.83 29.16,60.36 v1(29.13,60.39) ; RJ1.4 46.31,74.08 v1(42.14,74.08)
GPB1: length 32.6
  Top Layer w0.254: U7.2 26.9,47.92 26.9,73.65 v1(27.28,74.03)
  Bottom Layer w0.254: v1(27.28,74.03) 30.96,74.03 RJ2.4
GPB2: length 53.2
  Top Layer w0.254: v1(27.56,54.57) 27.56,47.31 U7.3 ; v1(9.3,54.42) 7.77,54.42 v1(5.82,52.46)
  Bottom Layer w0.254: v1(9.3,54.42) 9.45,54.57 v1(27.56,54.57) ; RJ4.4 7.34,33.01 4.06,36.28 4.06,50.71 v1(5.82,52.46)
GPB3: length 32.7
  Top Layer w0.254: v1(19.64,48.35) 14.25,53.73 8.33,53.73 7.37,52.77 7.37,49.37 8.42,48.31 RJ3.4 ; v1(23.72,45.2) 28.31,45.2 28.81,45.7 U7.4
  Bottom Layer w0.254: v1(19.64,48.35) 20.57,48.35 v1(23.72,45.2)
GPB4: length 56.2
  Top Layer w0.254: RJ8.4 74.63,47.8 74.63,44.9 73.79,44.06 71.17,44.06 68.81,46.42 v1(68.81,46.93) ; v1(66.27,47.28) 51.49,47.28 v1(49.58,45.38) ; U7.5 30.07,44.72 31.27,43.52 43.36,43.52 v1(43.89,44.06)
  Bottom Layer w0.254: v1(43.89,44.06) 48.26,44.06 v1(49.58,45.38) ; v1(66.27,47.28) 68.45,47.28 v1(68.81,46.93)
GPB5: length 54
  Top Layer w0.254: v1(47.17,45.1) 48.46,43.8 56.85,43.8 v1(58.5,42.15) ; v1(43.97,45.15) 42.85,44.03 32.36,44.03 31.34,45.05 U7.6
  Bottom Layer w0.254: RJ7.4 73.85,34.03 74.42,34.61 74.42,37.78 72.54,39.66 60.99,39.66 v1(58.5,42.15) ; v1(43.97,45.15) 47.12,45.15 v1(47.17,45.1)
GPB6: length 48.7
  Top Layer w0.254: v1(40.87,16.07) 40.87,25.52 41.2,25.85 41.2,26.56 32.23,35.52 v1(32.23,40.76) ; v1(32.16,45.28) 32.62,45.73 U7.7 ; v1(40.87,13.04) 35.56,7.74 34.7,7.74 33.32,9.11 RJ5.4
  Bottom Layer w0.254: v1(32.16,45.28) 32.16,40.83 v1(32.23,40.76) ; v1(40.87,16.07) v1(40.87,13.04)
GPB7: length 70.1
  Top Layer w0.254: v1(53.93,42.2) 54.03,42.1 v1(54.03,39.89) ; v1(54.05,37.3) v1(54.05,24.52) ; v1(44.07,51.73) 36.75,51.73 33.88,48.86 U7.8
  Bottom Layer w0.254: v1(54.03,39.89) 54.03,37.33 v1(54.05,37.3) ; RJ6.4 48.63,8.58 49.43,7.79 53.52,7.79 57.61,11.88 57.61,20.97 v1(54.05,24.52) ; v1(44.07,51.73) 44.4,51.73 v1(53.93,42.2)
GPI0: length 52.1
  Top Layer w0.254: R6.2 17.96,33.21 19.48,33.21 U1.12 27.15,25.54 v1(27.15,25.52) ; Q1.3 56.85,18.65 v1(56.85,17.49)
  Bottom Layer w0.254: v1(27.15,25.52) 31.95,20.71 49.96,20.71 53.19,17.49 v1(56.85,17.49)
GPI2: length 67.8
  Top Layer w0.254: LED2.1 4.12,69.43 v1(4.09,69.43) ; R19.2 16.74,34.99 v1(20.53,34.99) 21.99,33.52
  Bottom Layer w0.254: v1(4.09,69.43) 0.89,66.23 0.89,37.25 8.74,29.4 10.39,29.4 11.48,28.31 13.85,28.31 v1(20.53,34.99)
GPI015: length 5.4
  Top Layer w0.254: R20.2 22.4,37.91 22.4,35.94 U1.10
OUT+: length 14.7
  Top Layer w0.6: GNDENBAT.3 64.67,53.08 C20.1 64.73,57.34 D1.1 D4.1 ; 64.67,57.4 Q3.1
RPROG: length 3.5
  Top Layer w0.254: U8.2 58.46,69.06 56.33,66.92
RST: length 43.7
  Top Layer w0.254: v1(48.36,15.36) 50.12,15.36 SW1.1 53.52,22.18 C19.1 57.73,22.19 58.96,23.42 Q1.6 ; v1(27.59,14.34) 27.04,14.34 U1.1
  Bottom Layer w0.254: v1(27.59,14.34) 31.65,18.4 46.48,18.4 48.36,16.52 v1(48.36,15.36)
RTS: length 11.2
  Top Layer w0.254: 60.26,22.96 59.92,22.62 58.97,22.62 Q1.1 ; 60.26,22.96 v1(60.99,23.69) ; 60.26,22.96 Q1.5 ; v1(65.69,20.77) 66.22,20.77 U4.14
  Bottom Layer w0.254: v1(65.69,20.77) 62.76,23.69 v1(60.99,23.69)
RX: length 52
  Top Layer w0.254: v1(56.85,15.99) 59.65,15.99 U4.2 ; v1(23.67,21.4) 22.8,21.4 U1.15
  Bottom Layer w0.254: v1(23.67,21.4) 25.17,19.9 48.85,19.9 52.76,15.99 v1(56.85,15.99)
SC0: length 44.4
  Top Layer w0.254: U9.5 46.55,64.72 47.02,65.19 47.02,66.41 v1(46.4,67.02) R2.2 ; v1(43.89,42.46) 43.9,42.45 U2.5
  Bottom Layer w0.254: RJ1.6 49.84,72.78 51.84,70.78 51.84,69.48 49.38,67.02 v1(46.4,67.02) 42.37,62.99 42.37,43.98 v1(43.89,42.46)
SC1: length 42
  Top Layer w0.254: U2.7 42.6,41.51 v1(41.86,42.25) ; R25.2 v1(35.41,62.42) 34.67,63.16 34.67,64.28 35.12,64.72 U10.5
  Bottom Layer w0.254: v1(41.86,42.25) 41.07,43.04 41.07,56.76 v1(35.41,62.42) 36.53,63.54 36.53,70.98 34.72,72.79 RJ2.6
SC2: length 40.4
  Top Layer w0.254: U11.5 17.17,36.16 17.53,35.8 18.95,35.8 v1(19.47,36.32) R27.2 ; U2.9 41.3,39.07 41.29,39.05 v1(41.25,39.05)
  Bottom Layer w0.254: v1(41.25,39.05) 40.83,39.05 39.64,37.86 21.01,37.86 v1(19.47,36.32) 13.58,36.32 12.57,37.33 11.05,37.33 9.11,35.39 RJ4.6
SC3: length 45.8
  Top Layer w0.254: v1(39.4,38.44) 40,39.05 U2.11 ; R29.2 v1(14.87,47.09) 15.39,47.61 16.79,47.61 17.17,47.23 U12.5
  Bottom Layer w0.254: RJ3.6 9.11,50.55 11.2,52.64 12.22,52.64 14.87,49.99 v1(14.87,47.09) 23.52,38.44 v1(39.4,38.44)
SC4: length 43.9
  Top Layer w0.254: U2.14 40,36.86 41.12,37.99 49.76,37.99 50.98,39.21 56.69,39.21 R31.2 62.37,46.2 62.87,46.7 v1(64.31,46.7) 64.67,46.34 U13.5
  Bottom Layer w0.254: RJ8.6 73.09,46.99 70.84,44.74 69.93,44.74 67.97,46.7 v1(64.31,46.7)
SC5: length 43.5
  Top Layer w0.254: U14.5 64.67,34.99 64.95,34.71 v1(66.22,34.71) 66.97,35.46 R33.2 ; v1(45.31,36.72) 41.89,36.72 41.3,36.13 U2.16
  Bottom Layer w0.254: RJ7.6 73.08,31.94 70.87,29.73 69.04,29.73 66.22,32.55 v1(66.22,34.71) 65.51,35.42 47.27,35.42 45.97,36.72 v1(45.31,36.72)
SC6: length 41.3
  Top Layer w0.254: 35.61,13.27 v1(35.61,13.28) R35.2 33.86,14.92 33.4,15.38 33.4,16.02 34.51,17.12 U15.5 ; U2.18 42.6,26.18 41.45,25.03 41.45,17.84 v1(41.48,17.82)
  Bottom Layer w0.254: 36.29,13.28 36.94,13.28 v1(41.48,17.82) ; 36.29,13.28 v1(35.61,13.28) ; 36.29,13.28 37.47,12.1 37.47,10.88 36.91,10.33 32.39,10.33 31.18,9.12 RJ5.6
SC7: length 30.6
  Top Layer w0.254: U16.5 46.22,17.12 v1(46.53,17.44) 46.53,17.97 45.18,19.32 R37.2 44.44,22.71 43.9,23.24 U2.20
  Bottom Layer w0.254: RJ6.6 46.1,9.11 44.07,11.14 44.07,12 46.53,14.47 v1(46.53,17.44)
SCL: length 92
  Top Layer w0.254: U2.22 45.2,35.43 45.04,35.6 v1(43.56,35.6) ; v1(35.92,42.28) 35.92,33.55 v1(38.17,31.3) ; v1(38.28,45.73) 38.97,46.42 38.97,47.97 v1(37.44,49.49) ; 19.05,64.46 20.78,62.72 OLED.3 ; 19.05,64.46 18.44,63.84 16.18,63.84 R10.2 ; 19.05,64.46 U3.5 ; v1(33.61,26.73) 32.92,26.05 30.99,26.05 27.31,22.37 24.67,22.37 U1.14
  Bottom Layer w0.254: v1(38.28,45.73) 38.28,44.64 v1(35.92,42.28) ; v1(33.61,26.73) v1(38.17,31.3) 42.47,35.6 v1(43.56,35.6) ; v1(37.44,49.49) 34.82,49.49 29.77,54.55 29.77,60.58 28.41,61.94 21.75,61.94 OLED.3
SD0: length 32.9
  Top Layer w0.254: U2.4 44.55,43.37 45.24,44.06 R23.2 45.89,63.07 ; 45.89,63.07 U9.4 ; 45.89,63.07 47.75,64.94 47.75,69.08 RJ1.3
SD1: length 47.9
  Top Layer w0.254: U2.6 43.25,42.56 42.93,42.89 v1(40.29,42.89) ; U10.4 36.64,65.91 R24.2 34.4,67.02 RJ2.3
  Bottom Layer w0.254: RJ2.3 31.9,69.52 31.9,54.75 32.51,54.14 36.81,54.14 40.29,50.66 v1(40.29,42.89)
SD2: length 43.4
  Top Layer w0.254: U11.4 16.02,37.36 R26.2 14.87,35.21 RJ4.3 ; v1(37.95,37.05) 39.35,37.05 40.69,38.39 41.61,38.39 41.95,38.74 U2.8
  Bottom Layer w0.254: RJ4.3 12.82,33.16 17.38,33.16 21.26,37.05 v1(37.95,37.05)
SD3: length 35.9
  Top Layer w0.254: RJ3.3 12.38,48.02 18.29,48.02 19.47,46.84 R28.2 ; R28.2 22.22,43.04 39.19,43.04 40.65,41.58 U2.10 ; R28.2 18.82,46.44 U12.4
SD4: length 48.9
  Top Layer w0.254: U13.4 66.32,45.54 R30.2 66.97,48.37 68.68,50.08 70.27,50.08 RJ8.3 ; v1(39.35,36.21) 39.35,36.2 U2.13
  Bottom Layer w0.254: RJ8.3 65,50.35 56.06,41.42 44.55,41.42 v1(39.35,36.21)
SD5: length 45.7
  Top Layer w0.254: U2.15 40.65,36.52 41.48,37.35 v1(43.23,37.35) ; U14.4 63.52,36.46 R32.2 62.37,35.69 64.19,33.87 69.36,33.87 RJ7.3
  Bottom Layer w0.254: v1(43.23,37.35) 46.97,37.35 47.96,36.36 69.23,36.36 RJ7.3
SD6: length 28.2
  Top Layer w0.254: 34.95,18.67 32.64,16.36 32.64,14.39 34.24,12.79 34.24,11.66 RJ5.3 ; 34.95,18.67 R34.2 35.61,21.98 v1(36.37,22.75) ; 34.95,18.67 U15.4 ; v1(41.96,32.83) 41.96,34.27 U2.17
  Bottom Layer w0.254: v1(41.96,32.83) 41.96,28.33 v1(36.37,22.75)
SD7: length 30.4
  Top Layer w0.254: v1(43.26,32.32) 43.26,34.27 U2.19 ; 45.44,14.92 R36.2 45.09,15.57 U16.4 ; 45.44,14.92 47.35,16.83 v1(47.35,21.68) ; 45.44,14.92 46.38,14.92 RJ6.3
  Bottom Layer w0.254: v1(43.26,32.32) 43.26,28.77 47.35,24.68 v1(47.35,21.68)
SDA: length 92
  Top Layer w0.254: U1.13 25.26,24.6 27.41,24.6 30.2,27.39 v1(32.44,27.39) ; v1(37.72,50.74) 40.23,48.22 U7.13 40.23,46.37 v1(39.6,45.73) ; U3.4 17.73,65.07 v1(17.73,64.55) ; v1(45.85,35.9) 45.85,34.28 U2.23 ; v1(37.14,41.85) 37.14,34.51 v1(38.34,33.3) ; OLED.4 22.49,64.52 R12.2
  Bottom Layer w0.254: v1(39.6,45.73) 39.6,44.31 v1(37.14,41.85) ; v1(37.72,50.74) 35.28,50.74 30.91,55.11 30.91,61.91 28.31,64.52 OLED.4 22.73,64.55 v1(17.73,64.55) ; v1(32.44,27.39) v1(38.34,33.3) 41.5,36.46 43.77,36.46 44.15,36.08 45.67,36.08 v1(45.85,35.9)
STDBY#: length 15
  Top Layer w0.254: U8.6 65.85,67.79 66.96,68.9 66.96,71.61 65.71,72.86 R15.2
TX: length 49.7
  Top Layer w0.254: R21.1 59.37,14.03 v1(56.82,14.03) ; v1(23.67,19.14) 22.24,19.14 14.92,26.45
  Bottom Layer w0.254: v1(23.67,19.14) 46.71,19.14 51.82,14.03 v1(56.82,14.03)
$1N65: length 4.4
  Top Layer w0.254: U2.2 45.85,41.57 46.79,42.51 48.62,42.51
$1N66: length 2.1
  Top Layer w0.254: 48.62,40.31 48.61,40.32 U2.1
$1N67: length 4.5
  Top Layer w0.254: U2.21 44.55,33.02 46.2,31.37 R5.2
$2N78: length 7.4
  Top Layer w0.254: R8.2 77.61,12.23 75.54,12.23 74.19,10.88 73.42,10.88 72.26,12.05
$2N79: length 7.9
  Top Layer w0.254: USB1.A5 71.25,8.81 71.25,7.91 69.83,6.49 69.83,4.44 R9.1
$2N179: length 14.1
  Top Layer w0.254: R15.1 57.77,75.46 61.43,79.12 66.73,79.12 LED1.2
$2N191: length 11.1
  Top Layer w0.254: LED4.2 57.77,79.52 R14.1
$2N237: length 17.3
  Top Layer w0.254: U6.3 80.16,71.08 v1(79.88,71.08) ; v1(66.97,72.42) 67.71,71.69 Q2.6
  Bottom Layer w0.254: v1(79.88,71.08) 76.11,71.08 72.97,74.22 68.77,74.22 v1(66.97,72.42)
$2N238: length 13.5
  Top Layer w0.254: v1(78.57,68.02) 78.57,68.1 U6.1 ; Q2.4 69.05,73.01 v1(69.67,73.62)
  Bottom Layer w0.254: v1(78.57,68.02) 72.97,73.62 v1(69.67,73.62)
$2N249: length 13.9
  Top Layer w0.254: U6.5 78.84,71.05 78.84,70.22 76.94,68.31 v1(76.94,68.29) ; R11.1 70.56,68.01 C13.1 71.59,67.55 v1(72.42,67.55)
  Bottom Layer w0.254: v1(72.42,67.55) 76.2,67.55 v1(76.94,68.29)
$2N267: length 3.4
  Top Layer w0.254: R13.1 80.77,68.47 80.44,68.8 80.44,69.45 U6.2
$3N362: length 3.5
  Top Layer w0.254: LED2.2 7.12,72.33 R38.1
$3N426: length 8.3
  Top Layer w0.254: Q3.3 60.25,59.3 59.34,58.38 59.34,55.76 GNDENBAT.2
$3N452: length 2.9
  Top Layer w0.254: 28.43,18.6 30.46,16.58 30.51,16.58
$3N457: length 3.4
  Top Layer w0.254: U4.3 60.81,15.35 R21.2
$3N474: length 131
  Top Layer w0.254: R22.2 71.38,62.29 75.49,58.18 80.26,58.18 81.15,57.29 81.15,11.27 70.44,0.55 34.93,0.55 27.64,7.84 27.64,9.54 28.88,10.78 28.88,15.32 U1.2

## Copper pours and planes (outline as drawn; the poured copper is in the pictures)
GND on Top Layer: -9.09,93.16 90.65,93.16 90.65,-9.31 -9.09,-9.31
GND on Bottom Layer: -19.56,105.73 100.28,105.73 100.28,-20.84 -19.56,-20.84

## Text on the board
Bottom Silkscreen Layer: Design by KeonMan PCB by Holylemon | OctoSlime MKII
